# EasyEDA Pro project STM32_SG90稳定平台.eprj

# Schematic STM32_SG90稳定平台V1.1

## Sheets
1 STM32F103C8T6: Create Date: 2023-10-22; Page Name: STM32F103C8T6; Project Name: STM32_SG90稳定平台; Schematic Name: STM32_SG90稳定平台; Update Date: 2023-10-22; Add into BOM: yes; Company: 嘉立创EDA; Convert to PCB: yes; Page Size: A4; Version: V1.0
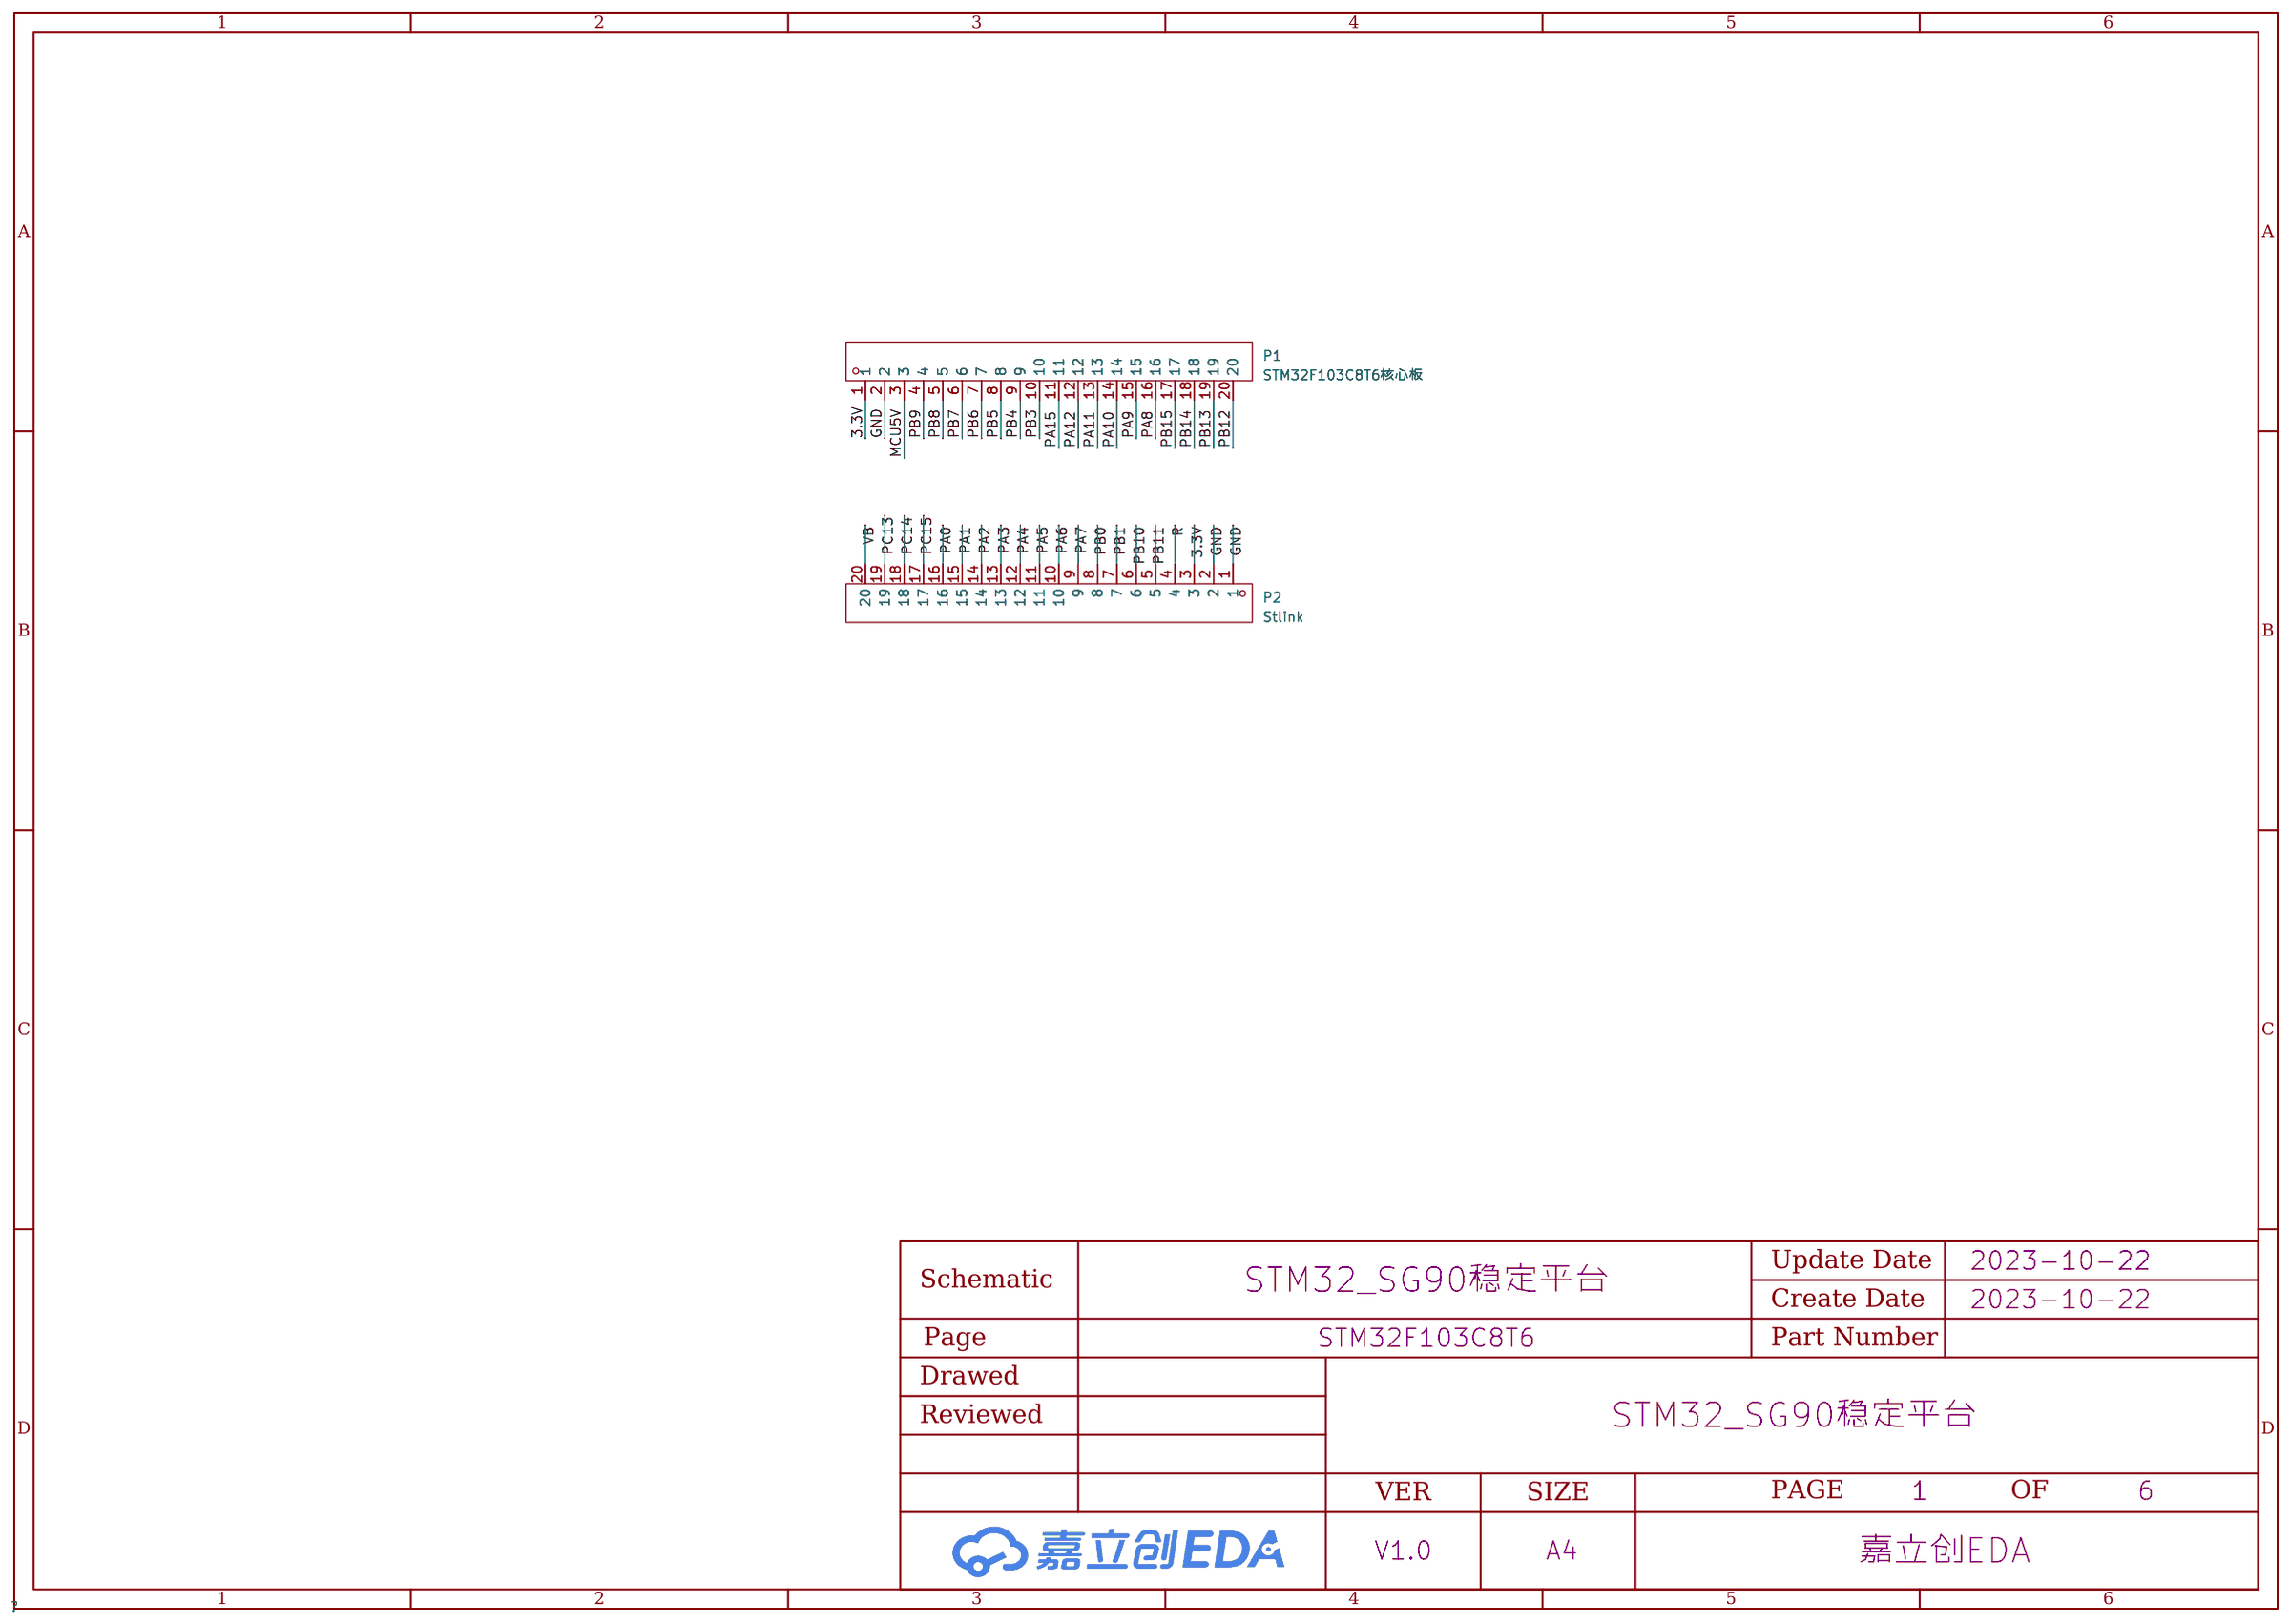
[diagram p0: STM32F103C8T6]
2 MPU6050: Page Name: MPU6050; Schematic Name: STM32_SG90稳定平台V1.1; Update Date: 2023-11-05
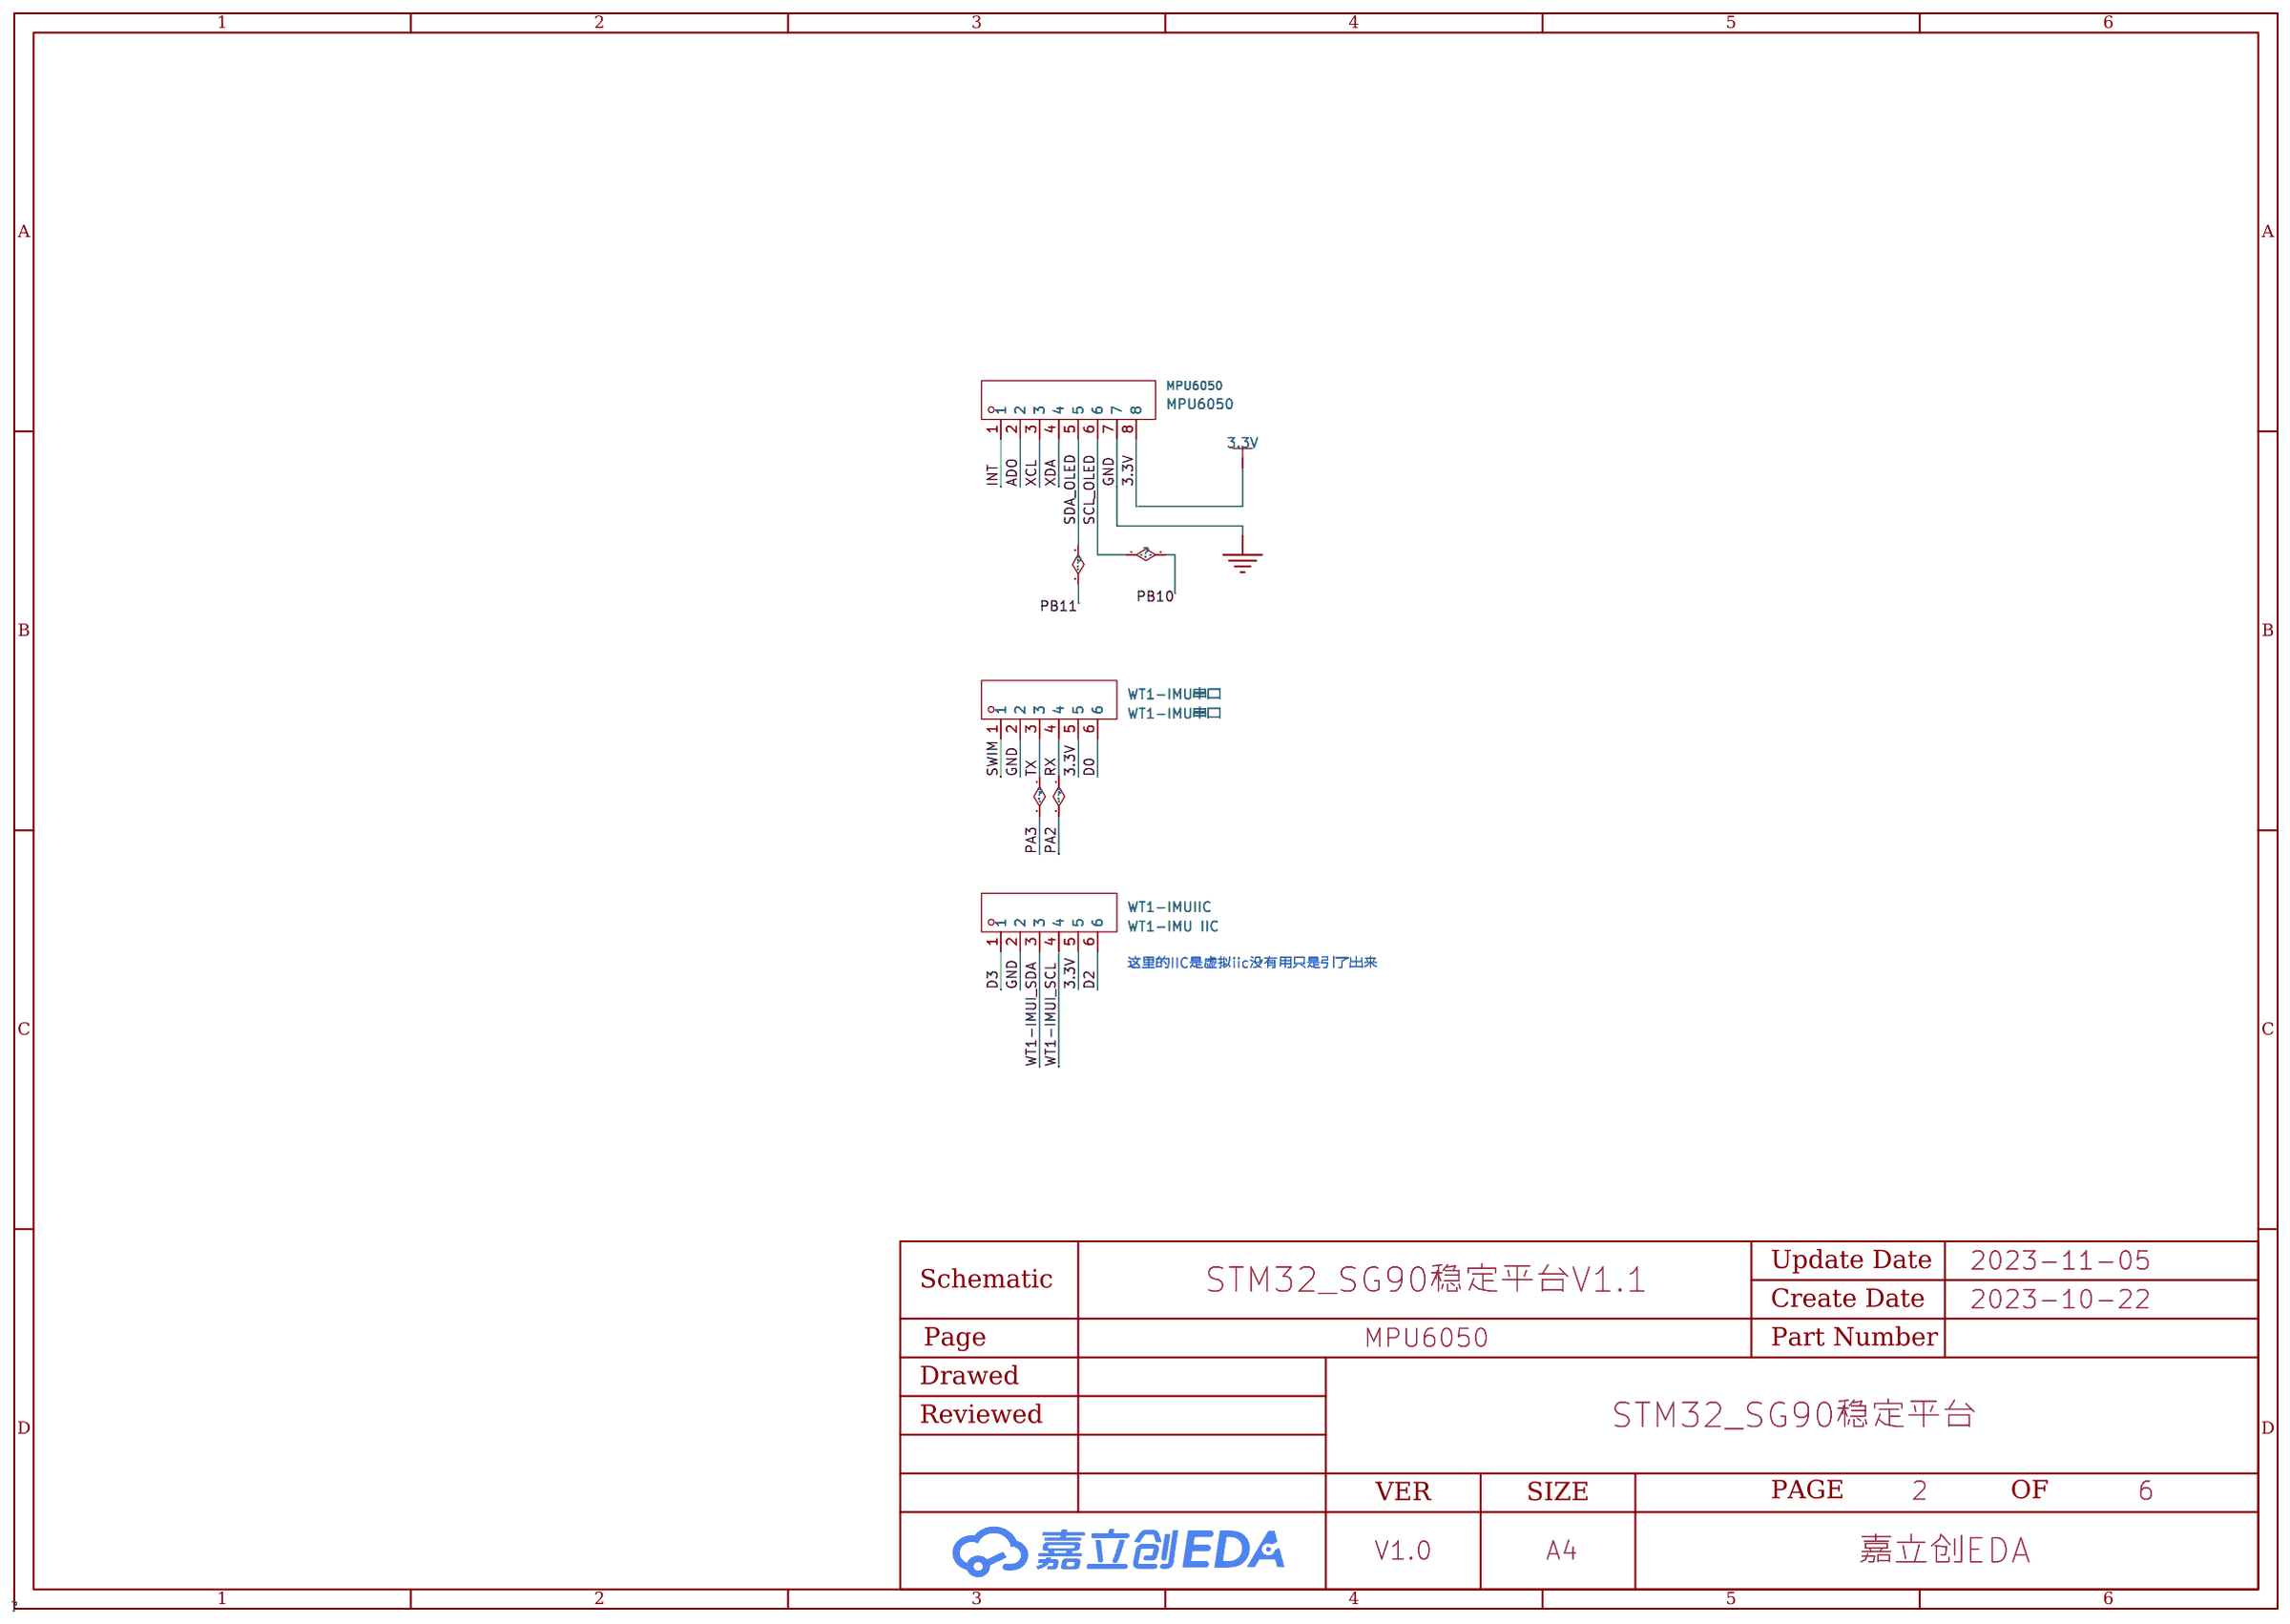
[diagram p1: MPU6050]
3 电源: Page Name: 电源; Schematic Name: STM32_SG90稳定平台V1.1; Update Date: 2023-10-24
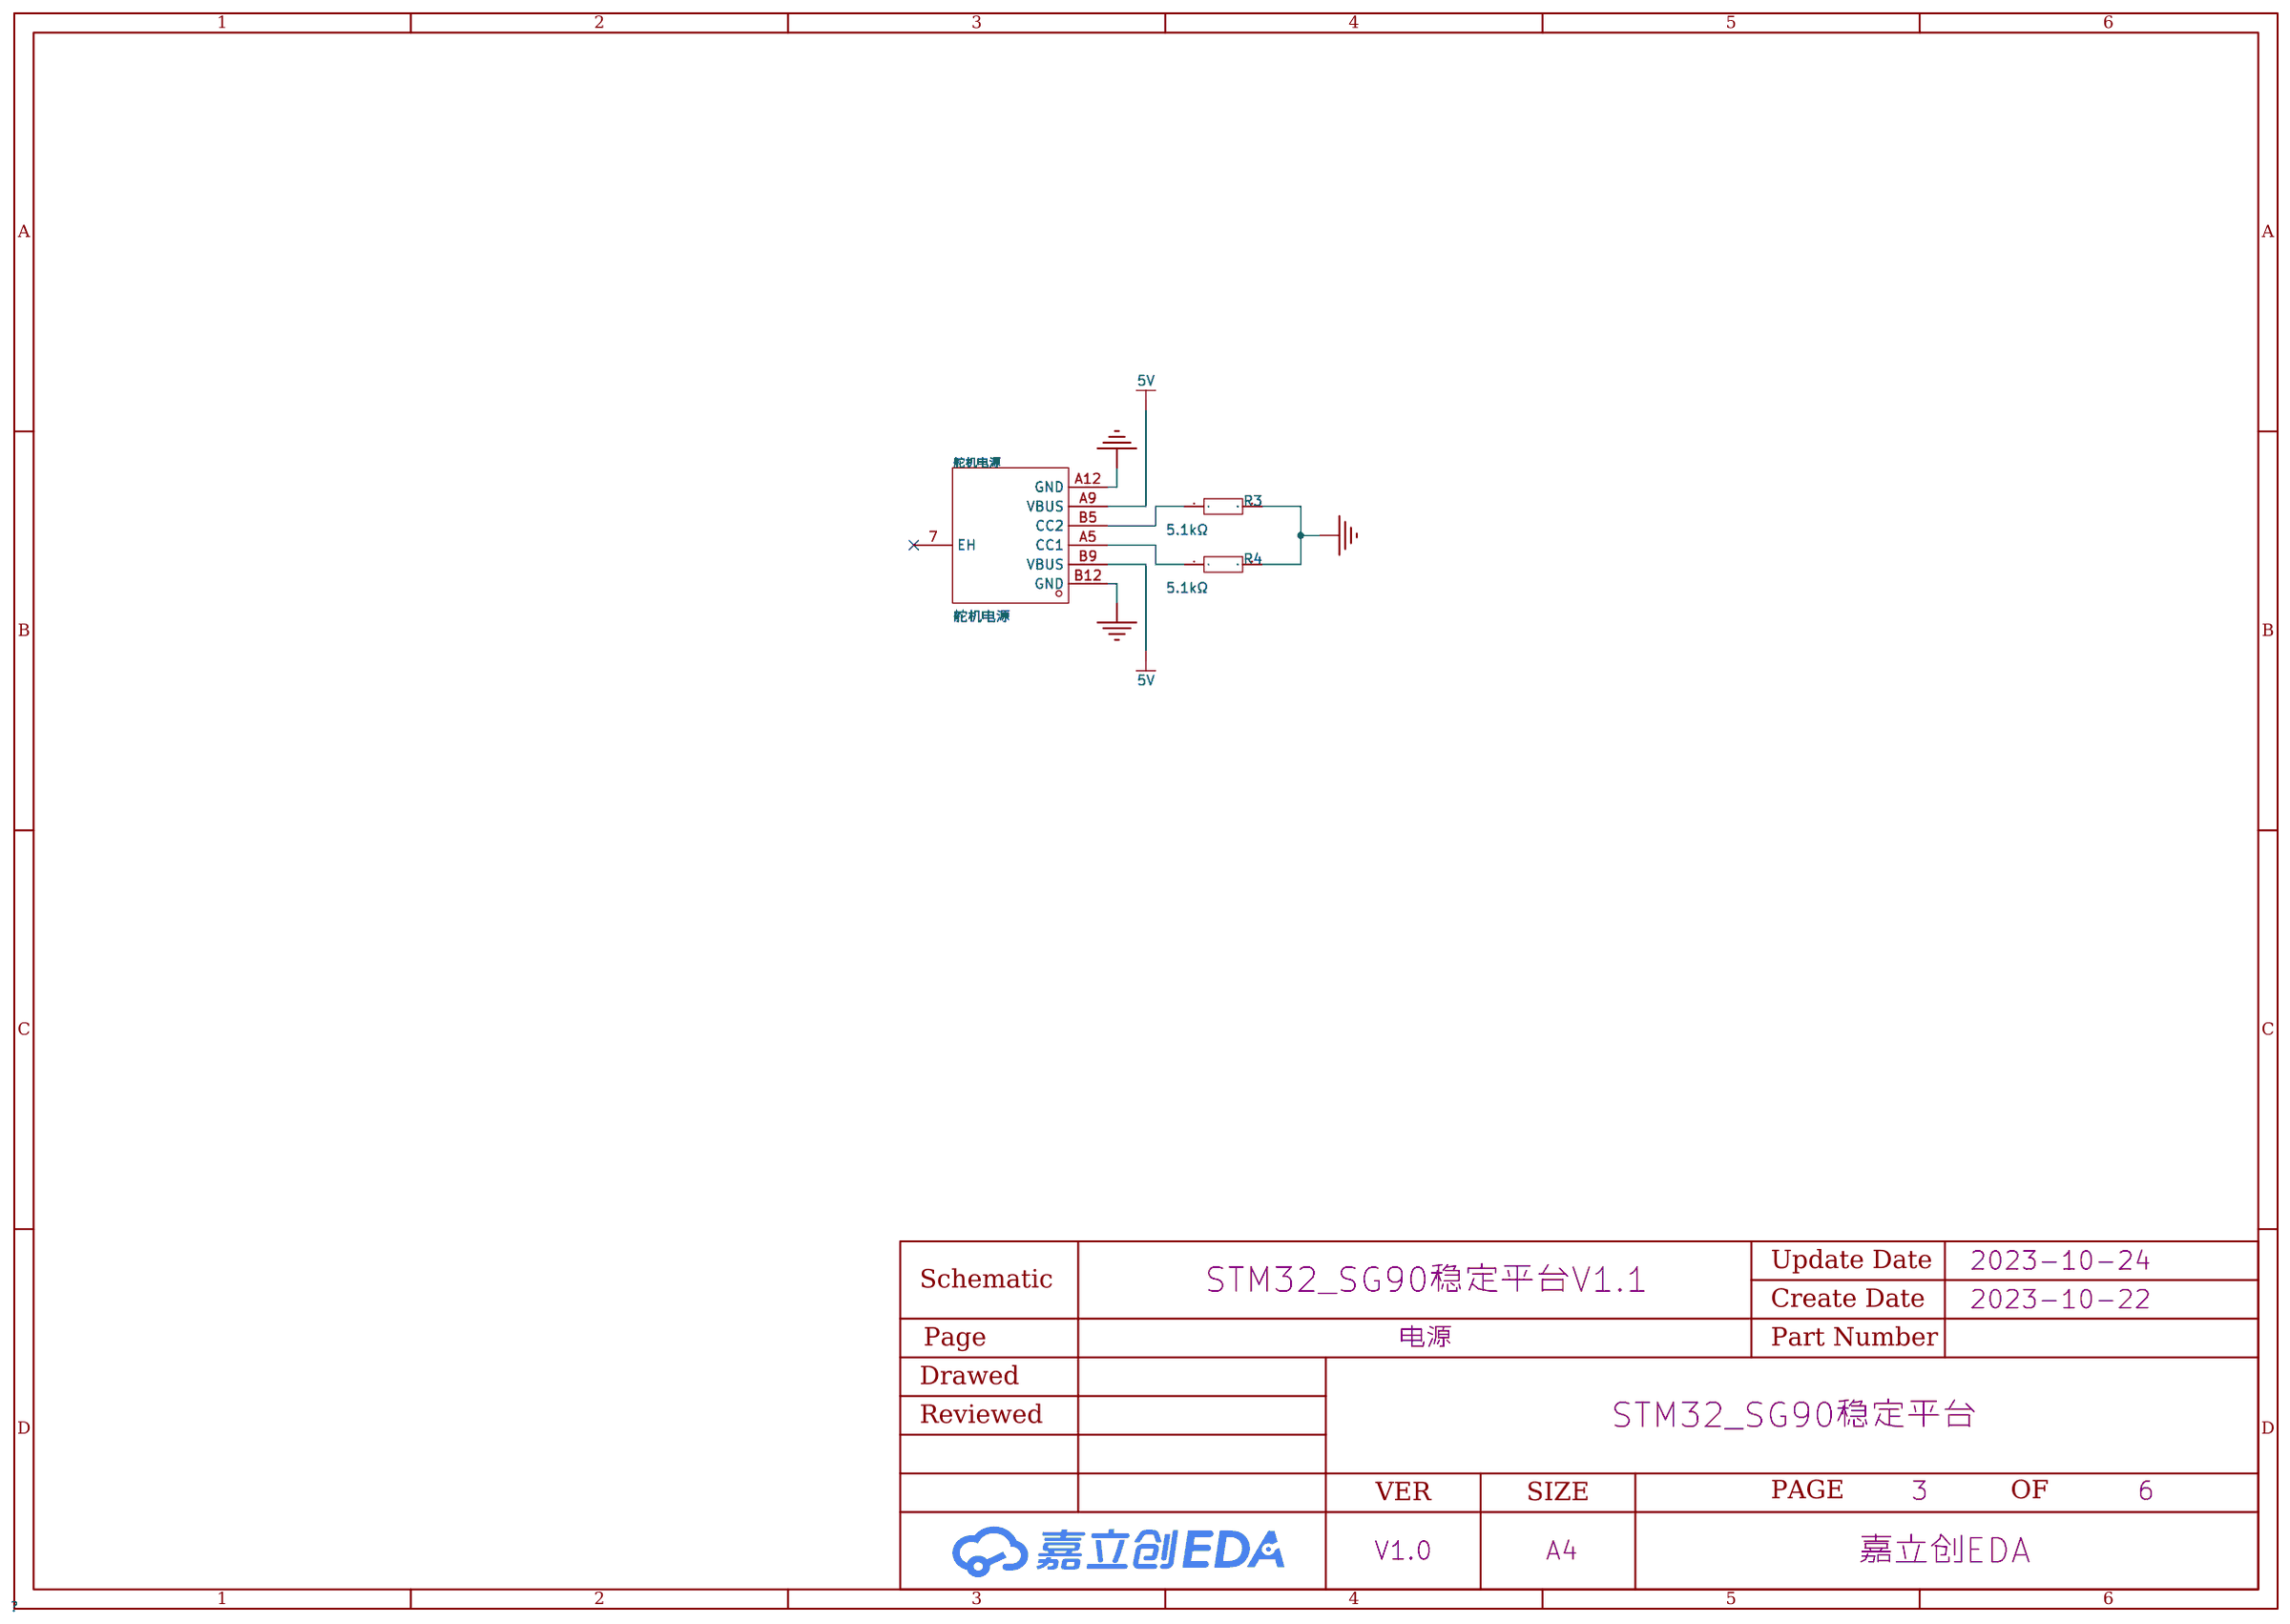
[diagram p2: 电源]
4 OLED: Page Name: OLED; Schematic Name: STM32_SG90稳定平台V1.1; Update Date: 2023-11-05
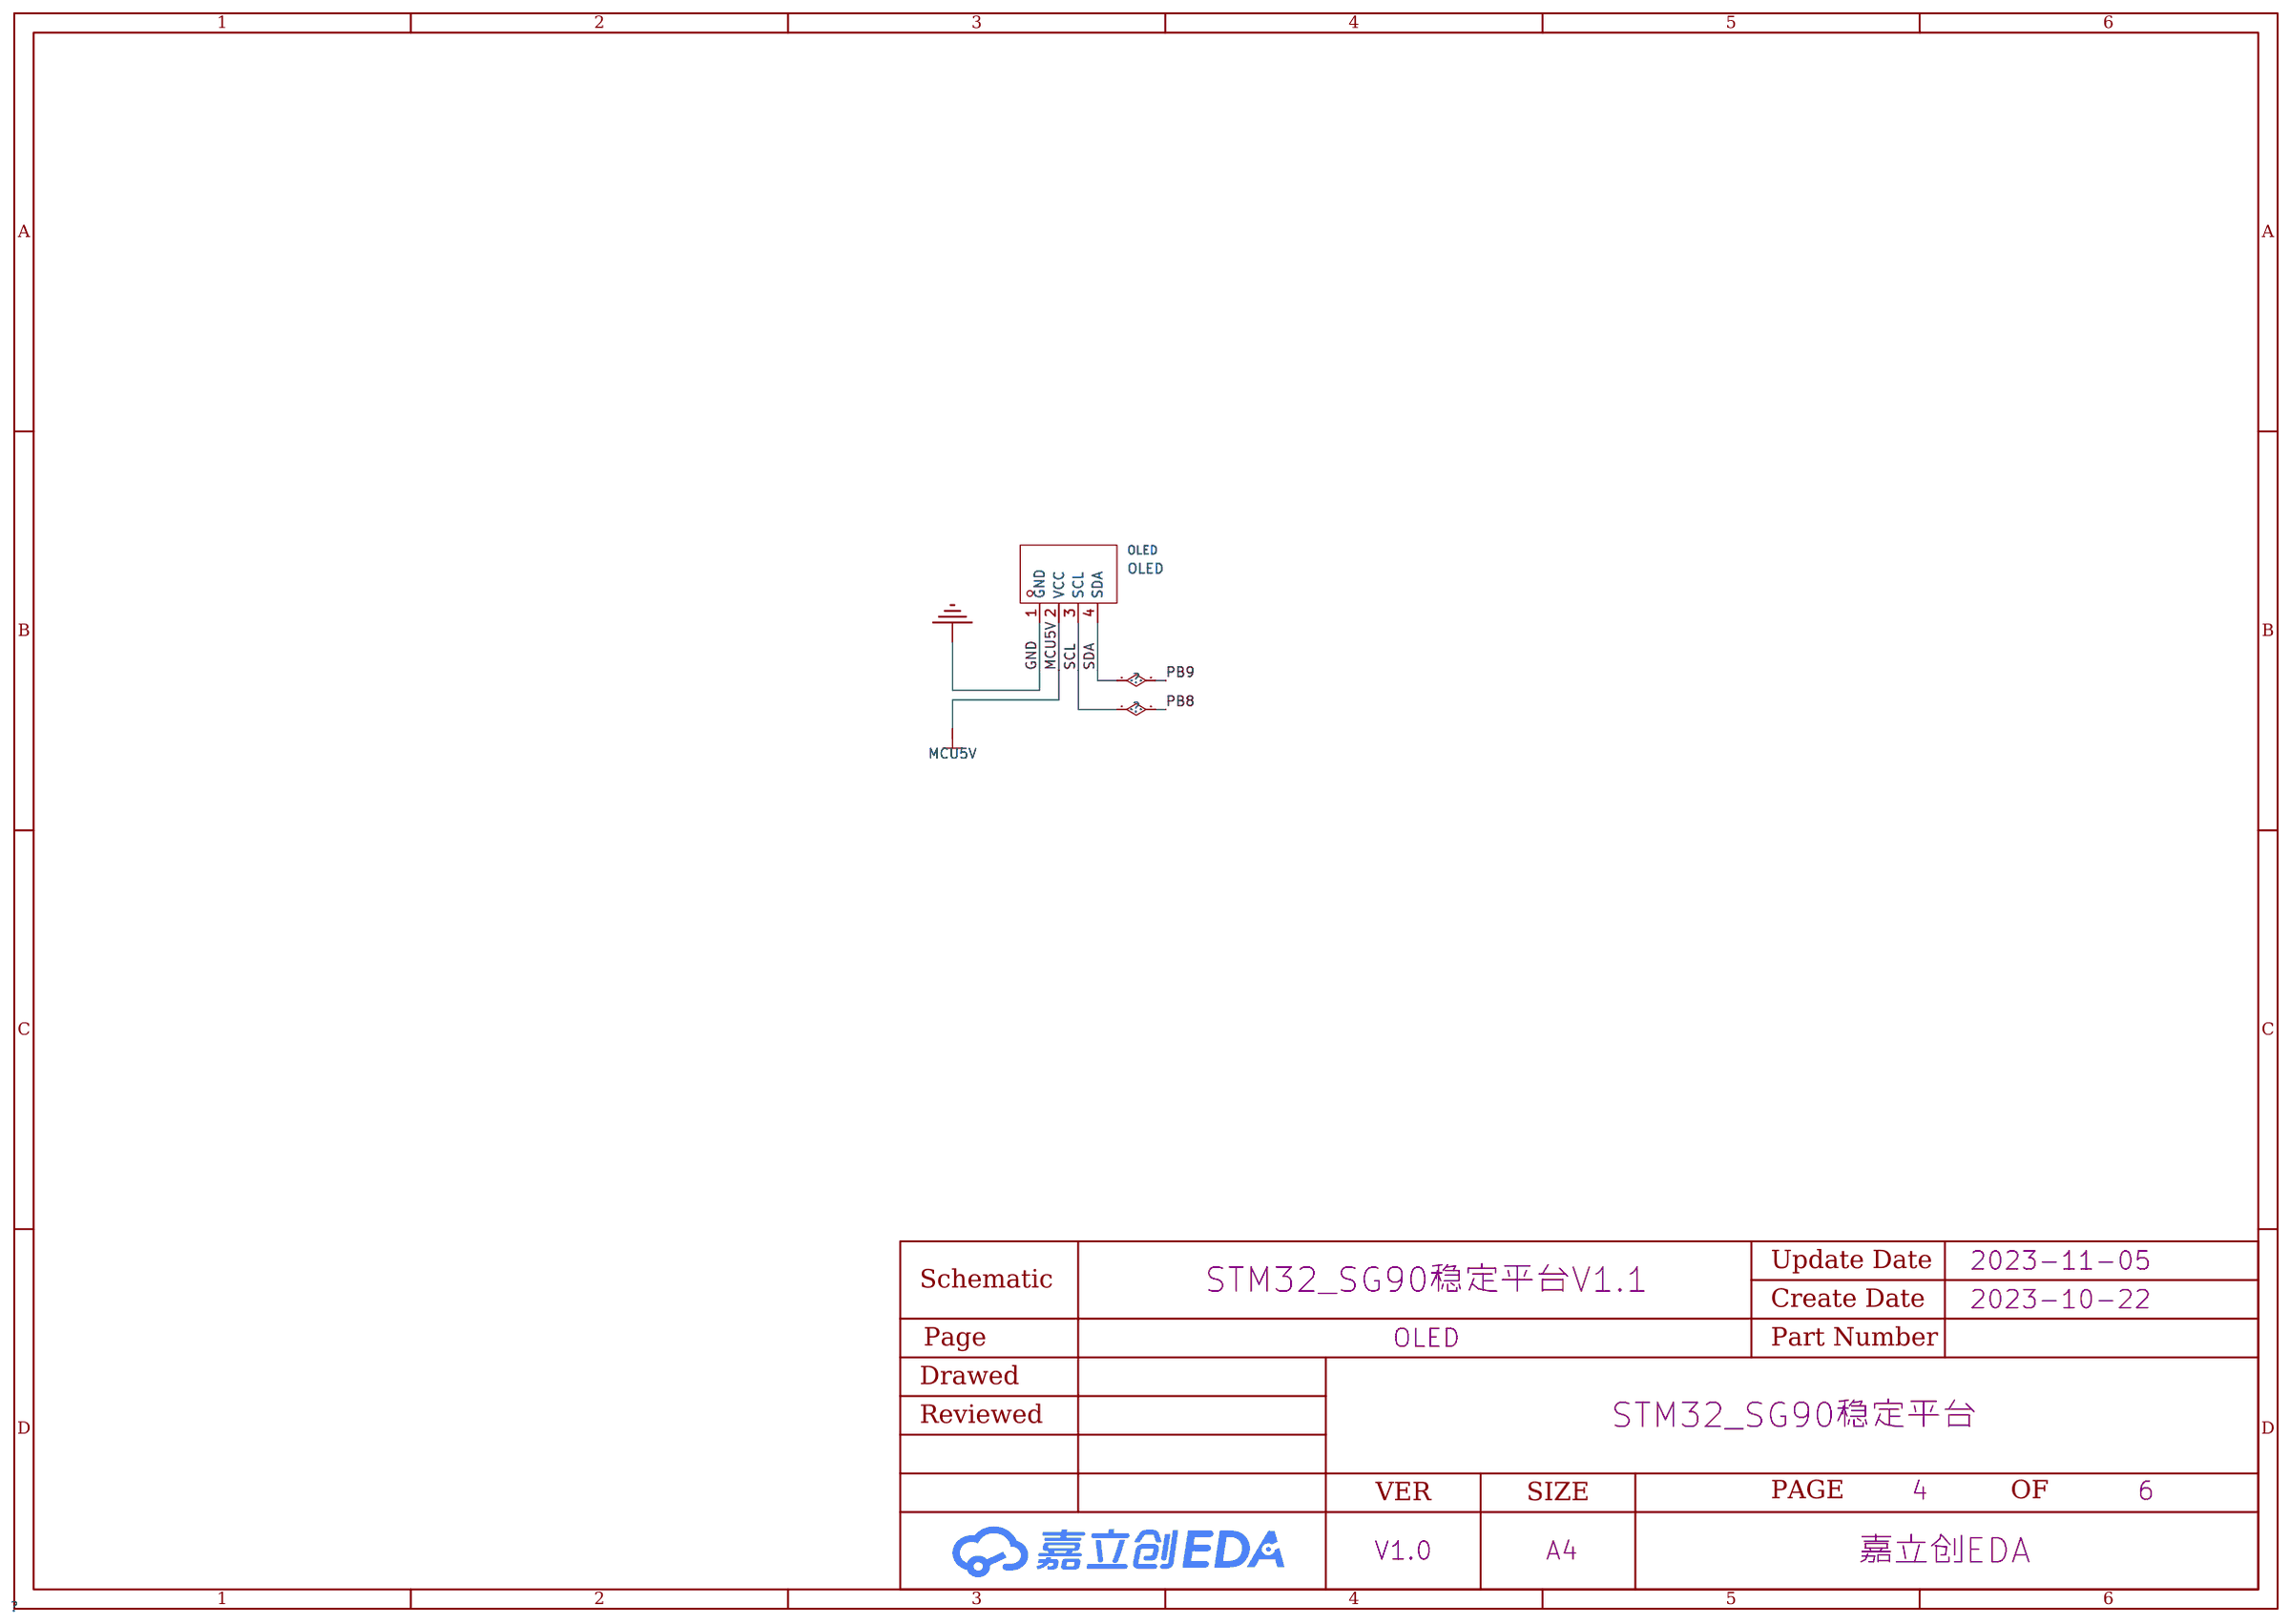
[diagram p3: OLED]
5 SG90舵机: Create Date: 2023-10-23; Page Name: SG90舵机; Schematic Name: STM32_SG90稳定平台V1.1; Update Date: 2023-11-05
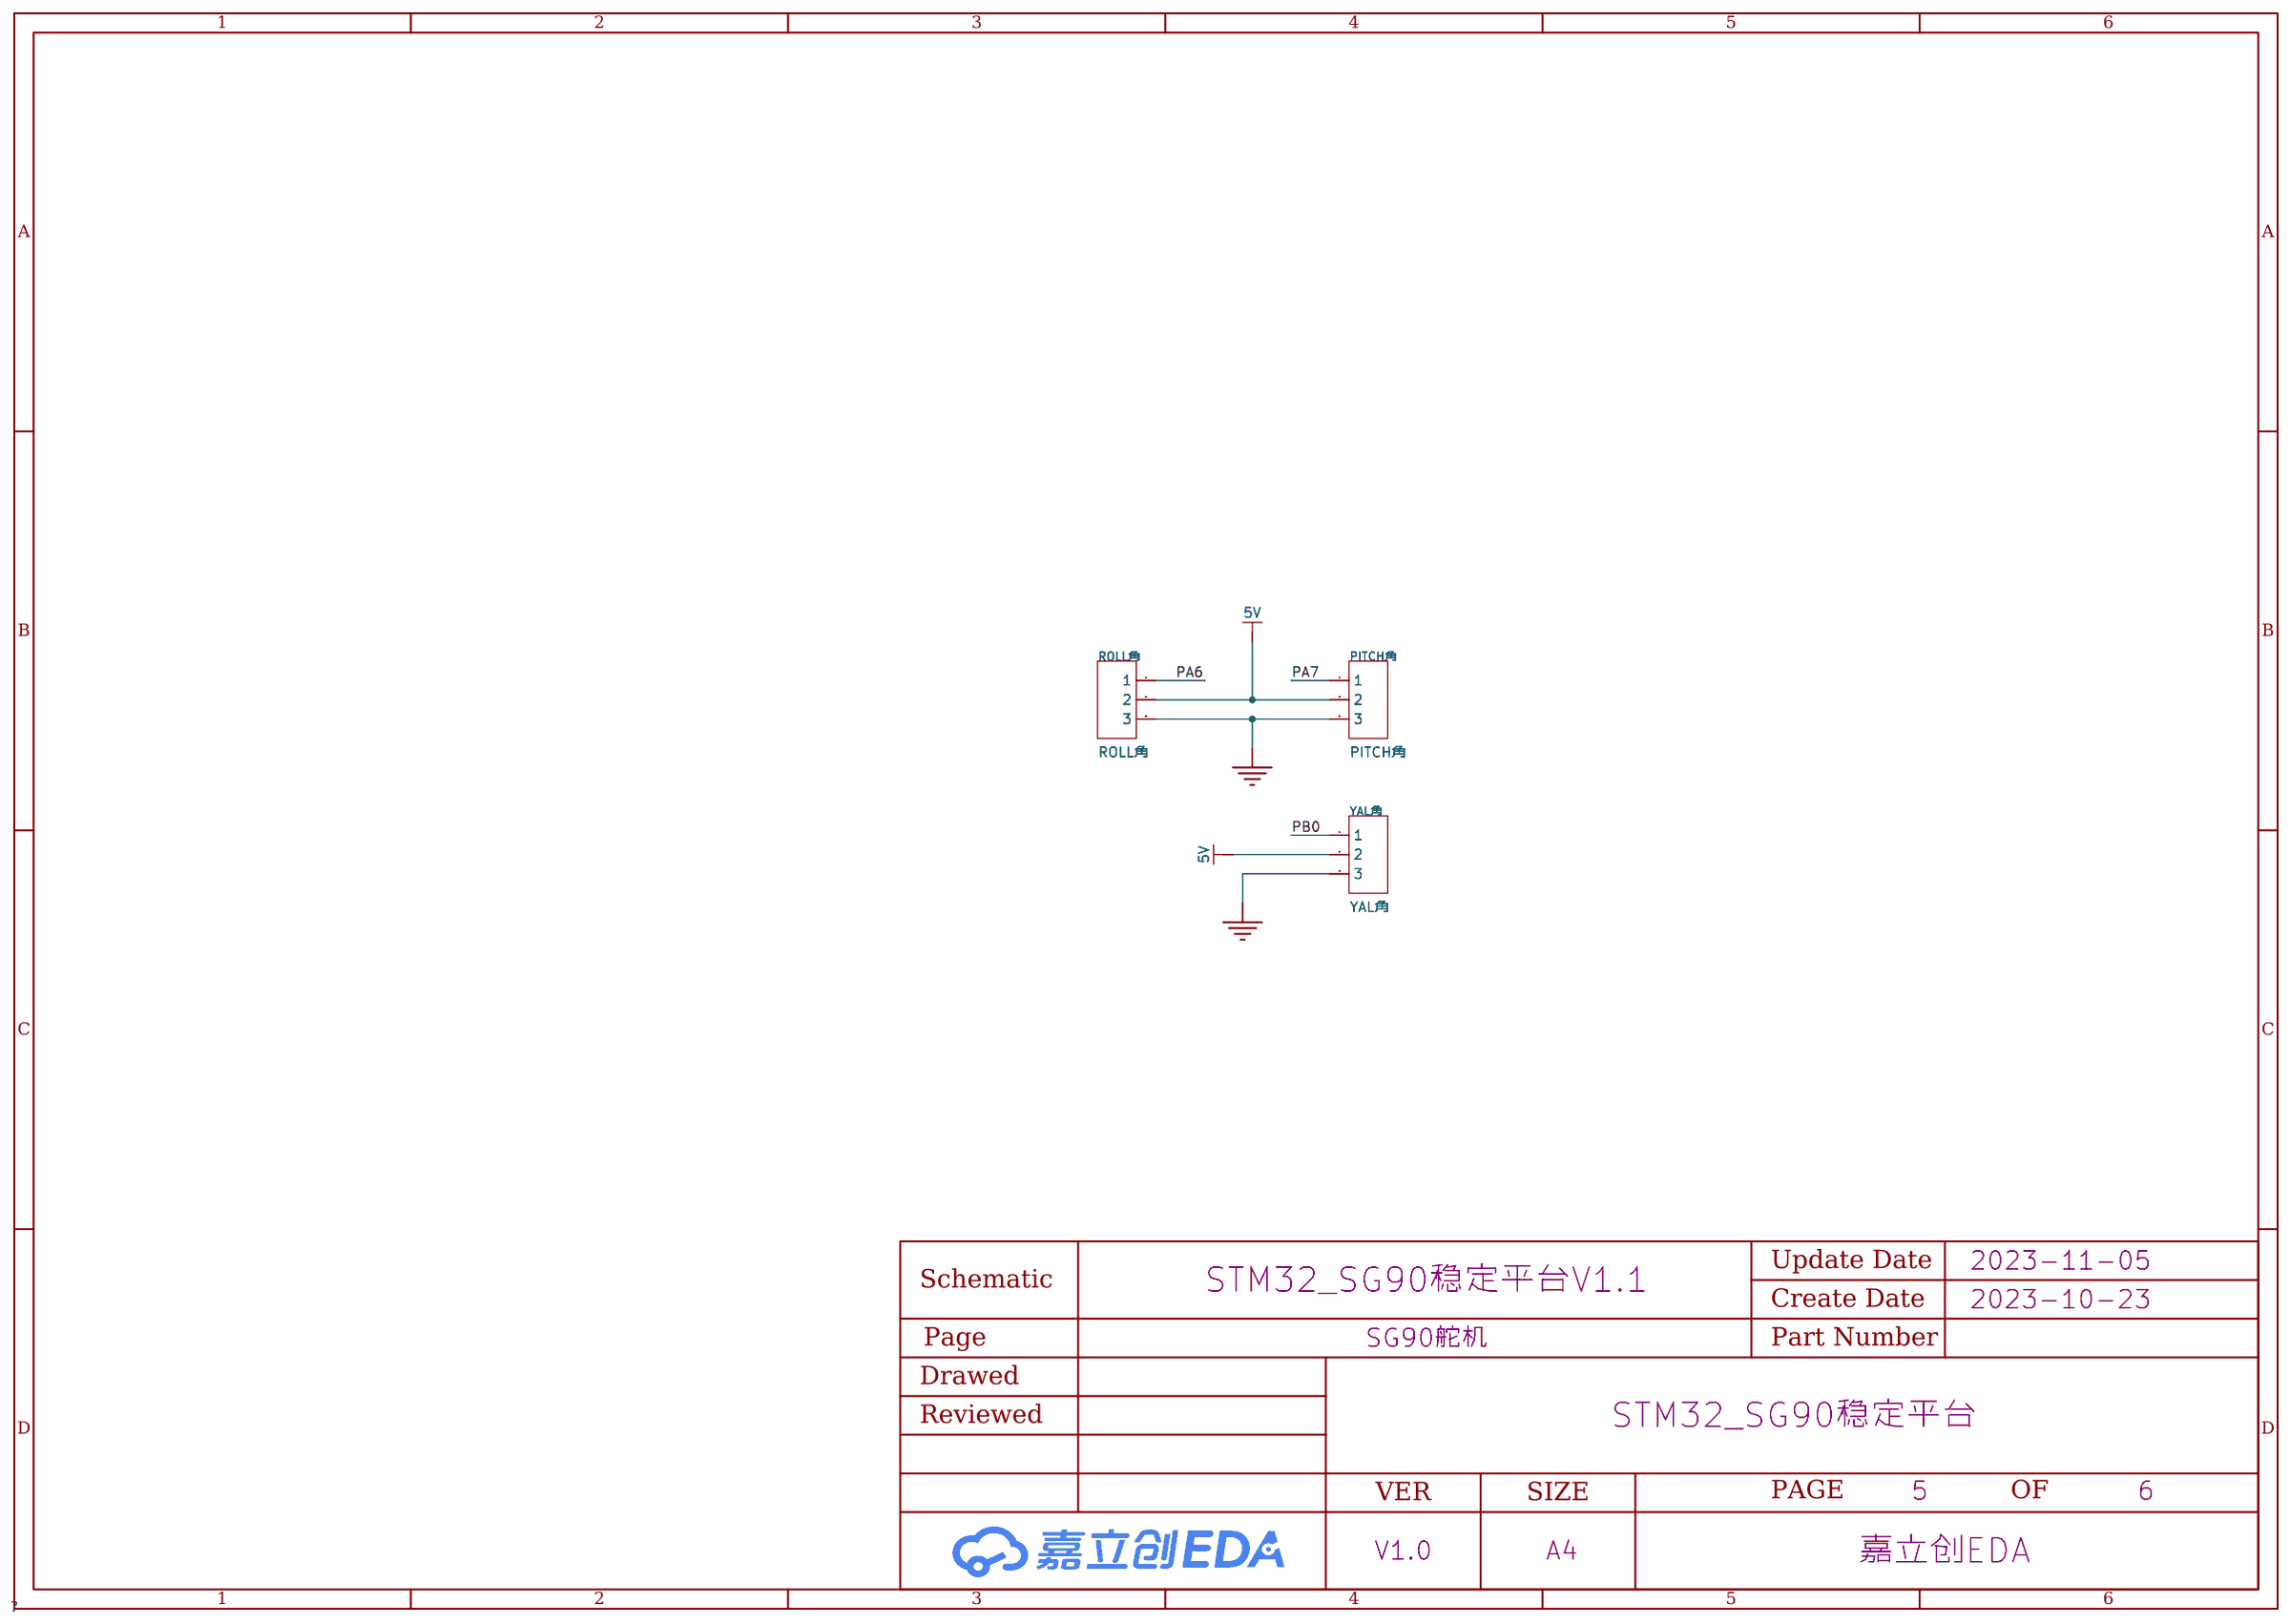
[diagram p4: SG90舵机]
6 串口: Create Date: 2023-10-23; Page Name: 串口; Schematic Name: STM32_SG90稳定平台V1.1; Update Date: 2023-10-24
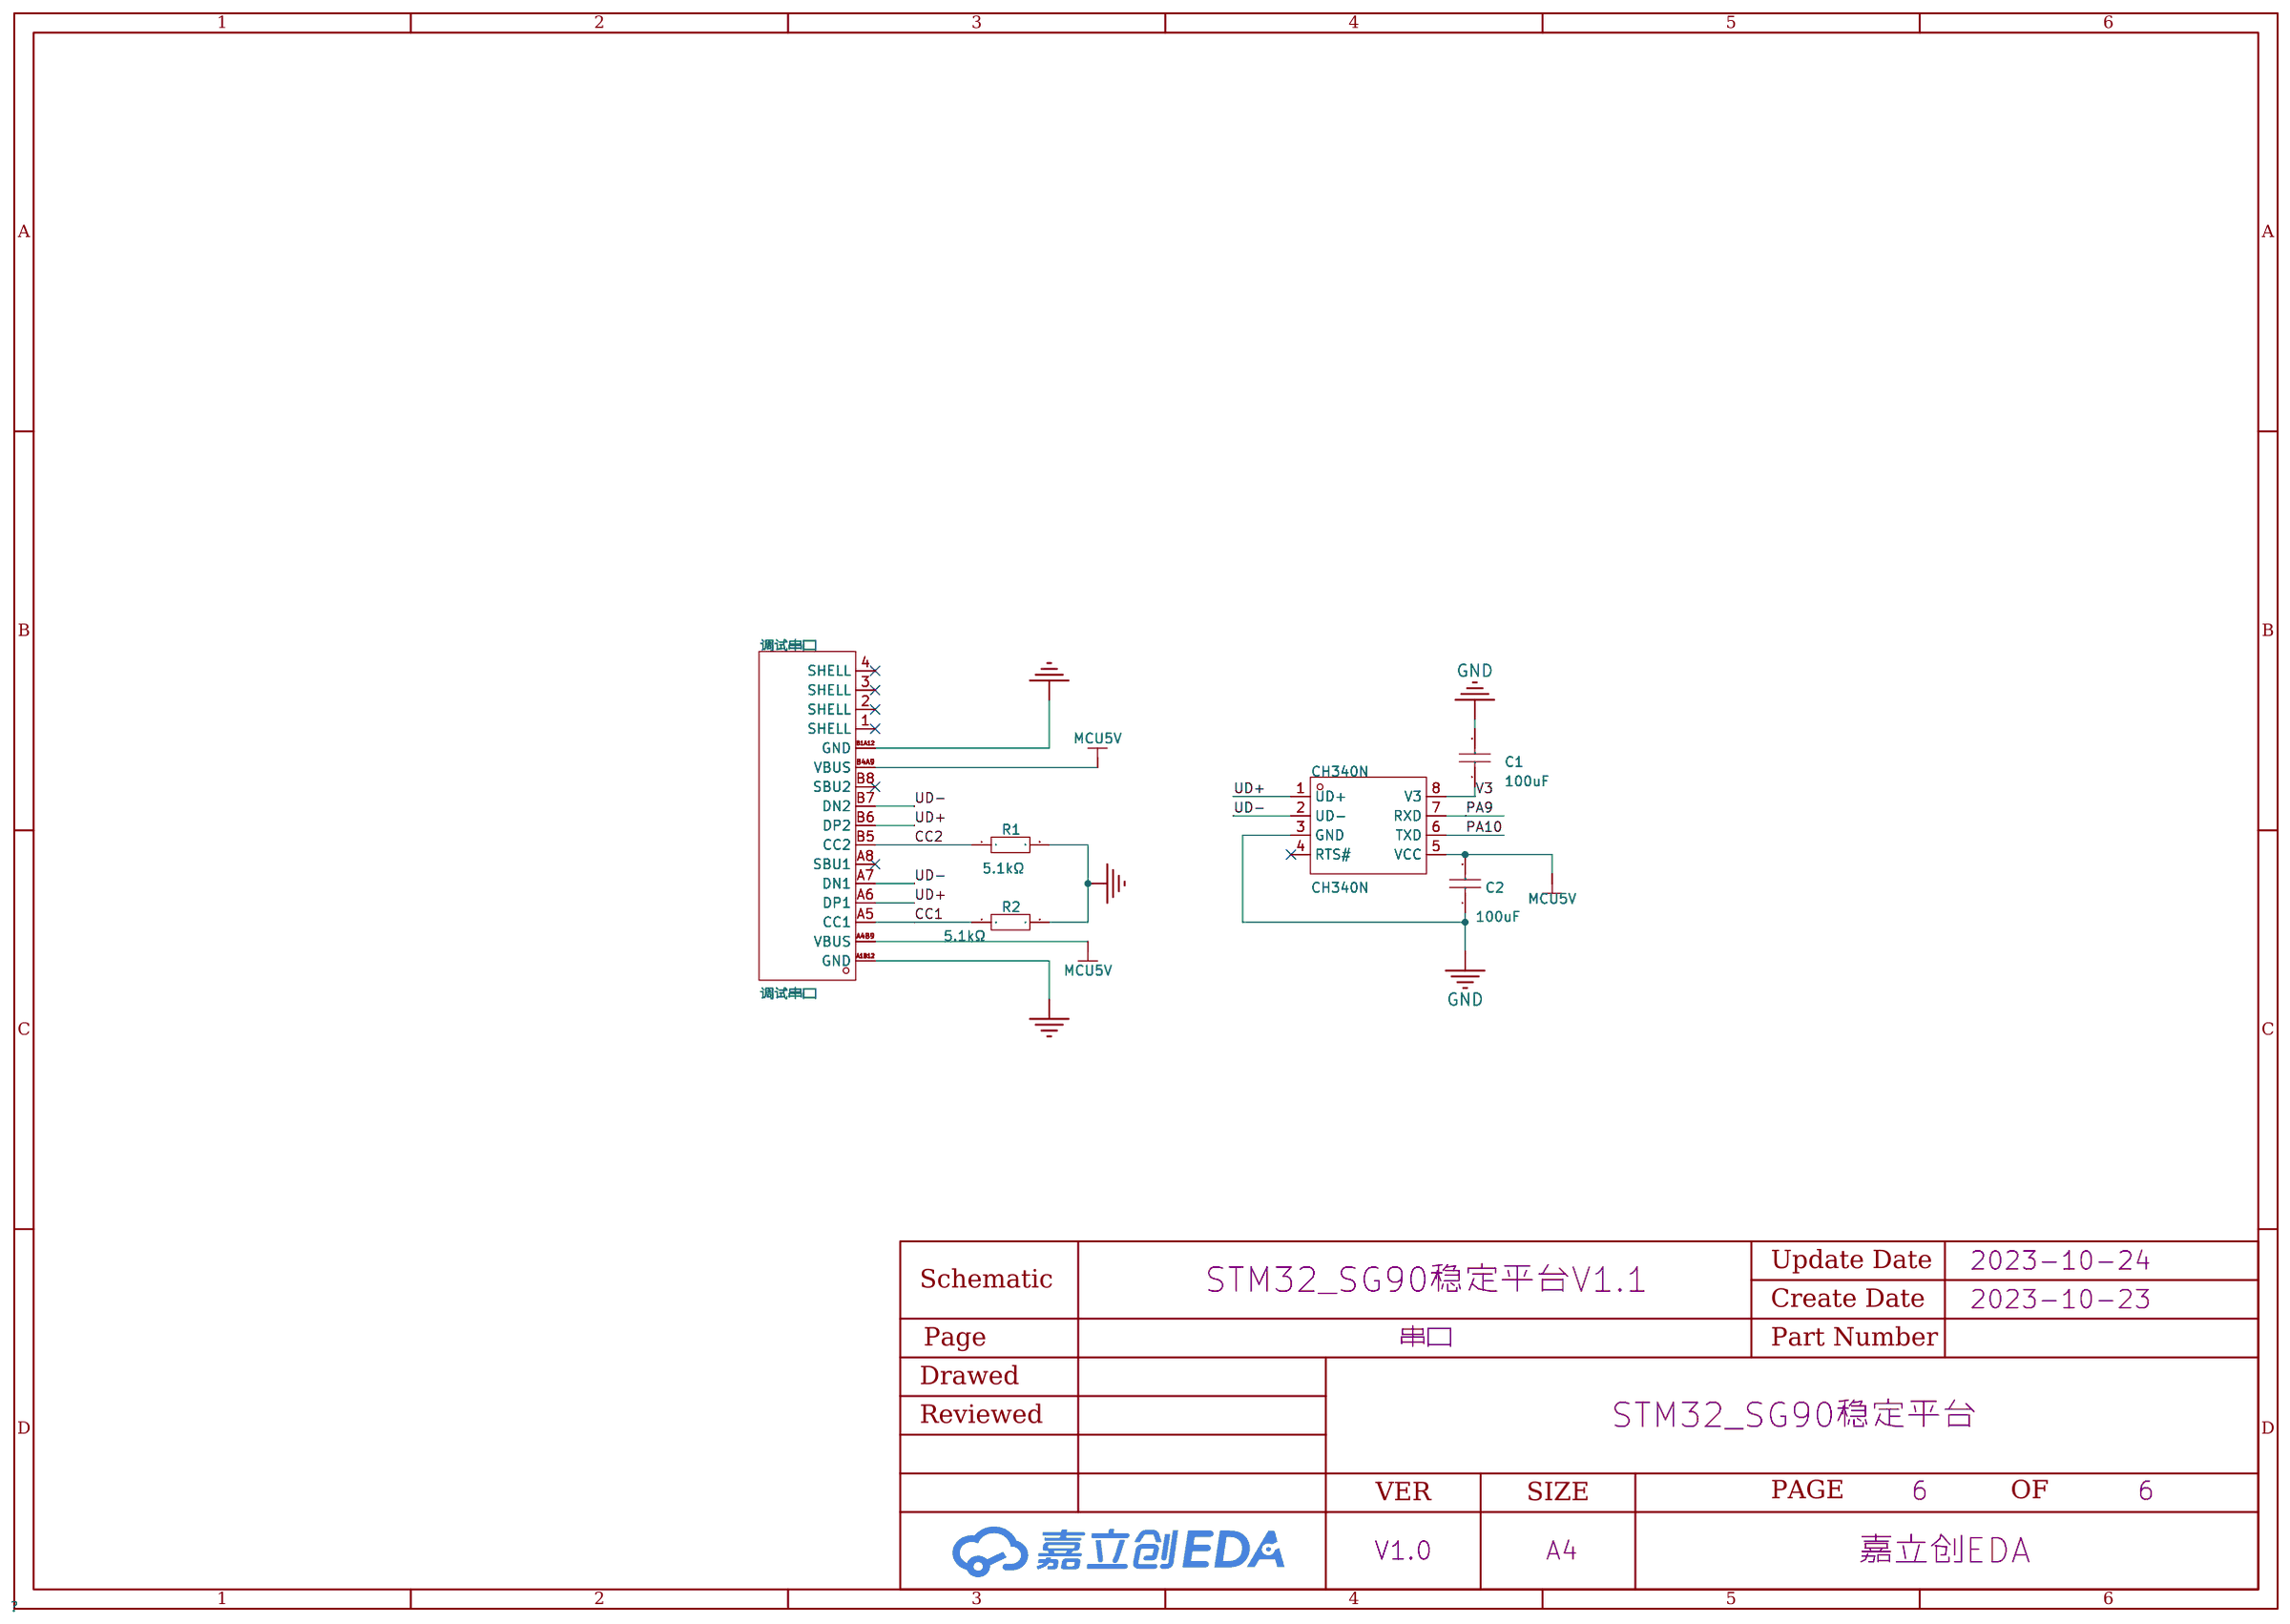
[diagram p5: 串口]

## Parts
sheet MPU6050
MPU6050  MPU6050  [HDR-TH_8P-P2.54-V-F]
WT1-IMUIIC  WT1-IMU IIC  [HDR-TH_6P-P2.54-V-F]
WT1-IMU串口  WT1-IMU串口  [HDR-TH_6P-P2.54-V-F]
sheet OLED
OLED  OLED  [OLED-TH_L27.8-W27.2-P2.54_C9900033791]
sheet SG90舵机
PITCH角  PITCH角  [HDR-TH_3P-P2.54-V-M-1]
ROLL角  ROLL角  [HDR-TH_3P-P2.54-V-M-1]
YAL角  YAL角  [HDR-TH_3P-P2.54-V-M-1]
sheet STM32F103C8T6
P1  STM32F103C8T6核心板  [HDR-TH_20P-P2.54-V-F]
P2  Stlink  [HDR-TH_20P-P2.54-V-F]
sheet 串口
C1  100uF  [C1206]
C2  100uF  [C1206]
CH340N  CH340N  [SOP-8_L4.9-W3.9-P1.27-LS6.0-BL]
R1  5.1kΩ  [R0603]
R2  5.1kΩ  [R0603]
调试串口  调试串口  [USB-C-SMD_TYPE-C16PIN]
sheet 电源
R3  5.1kΩ  [R0603]
R4  5.1kΩ  [R0603]
舵机电源  舵机电源  [TYPE-C-SMD_TYPE-C-6P]

## Library data of the parts
MPU6050 = ZX-PM2.54-1-8PY: 排数:单排;总孔位数:8P;间距:2.54mm;插孔结构:1x8P;行距:-;安装类型:直插;圆孔/方孔:方孔;额定电流:3A;额定电压:1kV;插孔方向:顶部;塑高:8.5mm;触头材质:青铜;触头镀层:金;工作温度范围:-40℃~+105℃;焊接温度(最大值):260℃@5S;; LCSC Part Name: 间距:2.54mm 1x8P 直插; Supplier Part: C7499328; Manufacturer: Megastar(兆星); Supplier Footprint: 插件,P=2.54mm; Datasheet: https://atta.szlcsc.com/upload/public/pdf/source/20230804/D626B3CF681C0E68EA183C516E9CB982.pdf; Supplier: LCSC; Number of Rows: 单排; Number of Holes: 8P; Pitch: 2.54mm; Holes Structure: 1x8P; Mounting Type: 直插; Circular Hole / Square Hole: 方孔; Current Rating (Max): 3A; Voltage Rating (Max): 1kV; Holes Direction: 顶部; Insulation Height: 8.5mm; Contact Material: 青铜; Contact Plating: 金; Operating Temperature Range: -40℃~+105℃; Welding Temperature (Max): 260℃@5S
WT1-IMUIIC WT1-IMU串口 = 2.54-1*6P母: 排数:单排;总孔位数:6P;间距:2.54mm;插孔结构:1x6P;行距:-;安装类型:直插;塑高:-;触头材质:-;触头镀层:-;; LCSC Part Name: 间距:2.54mm 1x6P 直插; Supplier Part: C40877; Manufacturer: BOOMELE(博穆精密); Supplier Footprint: 插件,P=2.54mm; JLCPCB Part Class: 扩展库; Datasheet: https://atta.szlcsc.com/upload/public/pdf/source/20210301/C2718488_F4427B881E42CAA8DDB0B1C12B3A522C.pdf; Supplier: LCSC; Number of Rows: 单排; Number of Holes: 6P; Pitch: 2.54mm; Holes Structure: 1x6P; Mounting Type: 直插
OLED = HS96L03W2C03: 尺寸(inch)：0.96寸 0.96&apos; 像素分辨率：128x64 128*64主控芯片：SSD1315 接口类型：I2C 外形:27.3*27.8；IIC/3SPI/4SPI串口通讯,工作温度范围-40℃—+70℃。4PIN黑底白光。; LCSC Part Name: 0.96寸OLED显示屏窄白光IIC; Supplier Part: C5248080; Manufacturer: HS(汉昇); JLCPCB Part Class: Extended Part; Datasheet: https://atta.szlcsc.com/upload/public/pdf/source/20230627/763D01F79A90007632F098068C7C8AD9.pdf; Supplier: LCSC
PITCH角 ROLL角 YAL角 = 2.54-1*3P针: 排数:单排;总PIN位数:3;间距:2.54mm;插针结构:1x3P;行距:-;安装类型:直插;圆针/方针:方针;额定电流:3A;额定电压:-;配合针长度:-;塑高:-;端接针长度:-;触头材质:-;触头镀层:-;工作温度范围:-40℃~+105℃;颜色:黑色;; LCSC Part Name: 2.54mm 1x3P 直插 方针; Supplier Part: C49257; Manufacturer: BOOMELE(博穆精密); Supplier Footprint: 直插,P=2.54mm; JLCPCB Part Class: 扩展库; Supplier: LCSC; Number of Rows: 单排; Number of Pins: 3; Pitch: 2.54mm; Pin Structure: 1x3P; Mounting Type: 直插; Circluar Pins/Square Pins: 方针; Current Rating (Max): 3A; Operating Temperature Range: -40℃~+105℃; Color: 黑色
P1 P2 = 22850120ANG1SYA01: 排数:单排;总孔位数:20P;间距:2.54mm;插孔结构:1x20P;行距:-;安装类型:直插;塑高:-;触头材质:黄铜;触头镀层:-;; LCSC Part Name: 间距:2.54mm 1x20P 直插; Supplier Part: C429947; Manufacturer: JILN(锦凌); Supplier Footprint: 插件,P=2.54mm; JLCPCB Part Class: 扩展库; Datasheet: https://atta.szlcsc.com/upload/public/pdf/source/20190920/C429966_F6288D72CB1EF194DAF75E8AC5D57877.pdf; Supplier: LCSC; Number of Rows: 单排; Number of Holes: 20P; Pitch: 2.54mm; Holes Structure: 1x20P; Mounting Type: 直插; Contact Material: 黄铜
C1 C2 = CL31A107MQHNNNE: 容值:100uF;精度:±20%;额定电压:6.3V;材质(温度系数):X5R;; LCSC Part Name: 100uF ±20% 6.3V; Supplier Part: C15008; Manufacturer: SAMSUNG(三星); Supplier Footprint: 1206; JLCPCB Part Class: Basic Part; Datasheet: https://atta.szlcsc.com/upload/public/pdf/source/20160103/1457707673200.pdf; Supplier: LCSC; Tolerance: ±20%; Voltage Rated: 6.3V; Temperature Coefficient: X5R
CH340N = CH340N: Supplier Part: C2977777; Manufacturer: WCH(南京沁恒); Supplier Footprint: SOP-8; JLCPCB Part Class: Extended Part; Datasheet: https://atta.szlcsc.com/upload/public/pdf/source/20220223/82A45E4FF89B3EDCAD50B354450A7EF4.pdf; Supplier: LCSC
R1-R4 = 0603WAF1002T5E: 电阻类型:厚膜电阻;阻值:10kΩ;精度:±1%;功率:100mW;; LCSC Part Name: 厚膜电阻 10kΩ ±1% 100mW; Supplier Part: C25804; Manufacturer: UNI-ROYAL(厚声); Supplier Footprint: 0603; JLCPCB Part Class: 基础库; Datasheet: https://atta.szlcsc.com/upload/public/pdf/source/20200306/C422600_1E6D84923E4A46A82E41ADD87F860B5C.pdf; Supplier: LCSC; Type: 厚膜电阻; Tolerance: ±1%; Power(Watts): 100mW; Temperature Coefficient: ±100ppm/℃; Overload Voltage (Max): 75V; Operating Temperature Range: -55℃~+155℃
调试串口 = TYPE-C16PIN: 连接器类型:Type-C;标准:-;公母:母座;触点数量:16;端口数量:1;安装方式:卧贴;额定电流 - 电源:3A;工作温度范围:-40℃~+85℃;; LCSC Part Name: Type-C 母座 卧贴 快充闪充 停产; Supplier Part: C393939; Manufacturer: SHOU HAN(首韩); Supplier Footprint: SMD; JLCPCB Part Class: Extended Part; Datasheet: https://atta.szlcsc.com/upload/public/pdf/source/20190521/C393939_7B9043D4CF1026AF443AB60D91FBCD5C.pdf; Supplier: LCSC; Connector Type: Type-C; Gender: 母座; Number of Contacts: 16; Number of Ports: 1; Mounting Style: 卧贴; Current Rating - Power (Max): 3A; Operating Temperature Range: -40℃~+85℃
舵机电源 = TYPE-C 6P(073): 连接器类型:Type-C;标准:-;公母:母座;触点数量:6P;端口数量:1;安装方式:卧贴;额定电流 - 电源:5A;工作温度范围:-25℃~+85℃;; LCSC Part Name: Type-C 母座 卧贴; Supplier Part: C668623; Manufacturer: SHOU HAN(首韩); Supplier Footprint: SMD; JLCPCB Part Class: Extended Part; Datasheet: https://atta.szlcsc.com/upload/public/pdf/source/20200618/C668623_A4B260DED7AC1949BAC6AE39E9F4CD80.pdf; Supplier: LCSC; Connector Type: Type-C; Gender: 母座; Number of Contacts: 6P; Number of Ports: 1; Mounting Style: 卧贴; Current Rating - Power (Max): 5A; Operating Temperature Range: -25℃~+85℃

## Nets
3.3V: MPU6050.8 P1.1 P2.3 WT1-IMUIIC.5 WT1-IMU串口.5
5V: PITCH角.2 ROLL角.2 YAL角.2 舵机电源.A9(VBUS) 舵机电源.B9(VBUS)
GND: C1.1 C2.1 CH340N.3(GND) MPU6050.7 OLED.1(GND) P1.2 P2.1 P2.2 PITCH角.3 R1.2 R2.2 R3.2 R4.2 ROLL角.3 WT1-IMUIIC.2 WT1-IMU串口.2 YAL角.3 舵机电源.A12(GND) 舵机电源.B12(GND) 调试串口.A1B12(GND) 调试串口.B1A12(GND)
V3: C1.2 CH340N.8(V3)
ADO: MPU6050.2
CC1: R2.1 调试串口.A5(CC1)
CC2: R1.1 调试串口.B5(CC2)
D0: WT1-IMU串口.6
D2: WT1-IMUIIC.6
D3: WT1-IMUIIC.1
INT: MPU6050.1
MCU5V: C2.2 CH340N.5(VCC) OLED.2(VCC) P1.3 调试串口.A4B9(VBUS) 调试串口.B4A9(VBUS)
PA0: P2.16
PA1: P2.15
PA2: P2.14 WT1-IMU串口.4
PA3: P2.13 WT1-IMU串口.3
PA4: P2.12
PA5: P2.11
PA6: P2.10 ROLL角.1
PA7: P2.9 PITCH角.1
PA8: P1.16
PA9: CH340N.7(RXD) P1.15
PA10: CH340N.6(TXD) P1.14
PA11: P1.13
PA12: P1.12
PA15: P1.11
PB0: P2.8 YAL角.1
PB1: P2.7
PB3: P1.10
PB4: P1.9
PB5: P1.8
PB6: P1.7
PB7: P1.6
PB8: OLED.3(SCL) P1.5
PB9: OLED.4(SDA) P1.4
PB10: MPU6050.6 P2.6
PB11: MPU6050.5 P2.5
PB12: P1.20
PB13: P1.19
PB14: P1.18
PB15: P1.17
PC13: P2.19
PC14: P2.18
PC15: P2.17
R: P2.4
SWIM: WT1-IMU串口.1
UD+: CH340N.1(UD+) 调试串口.A6(DP1) 调试串口.B6(DP2)
UD-: CH340N.2(UD-) 调试串口.A7(DN1) 调试串口.B7(DN2)
VB: P2.20
WT1-IMUI_SCL: WT1-IMUIIC.4
WT1-IMUI_SDA: WT1-IMUIIC.3
XCL: MPU6050.3
XDA: MPU6050.4
$3N1347: R3.1 舵机电源.B5(CC2)
$3N1356: R4.1 舵机电源.A5(CC1)

Not connected (* = marked no-connect by the designer): CH340N 4(RTS#)*; 舵机电源 7(EH)*; 调试串口 1(SHELL)* 2(SHELL)* 3(SHELL)* 4(SHELL)* A8(SBU1)* B8(SBU2)*

## Notes on the sheets
sheet 2
- 这里的IIC是虚拟iic没有用只是引了出来

# Board PCB1
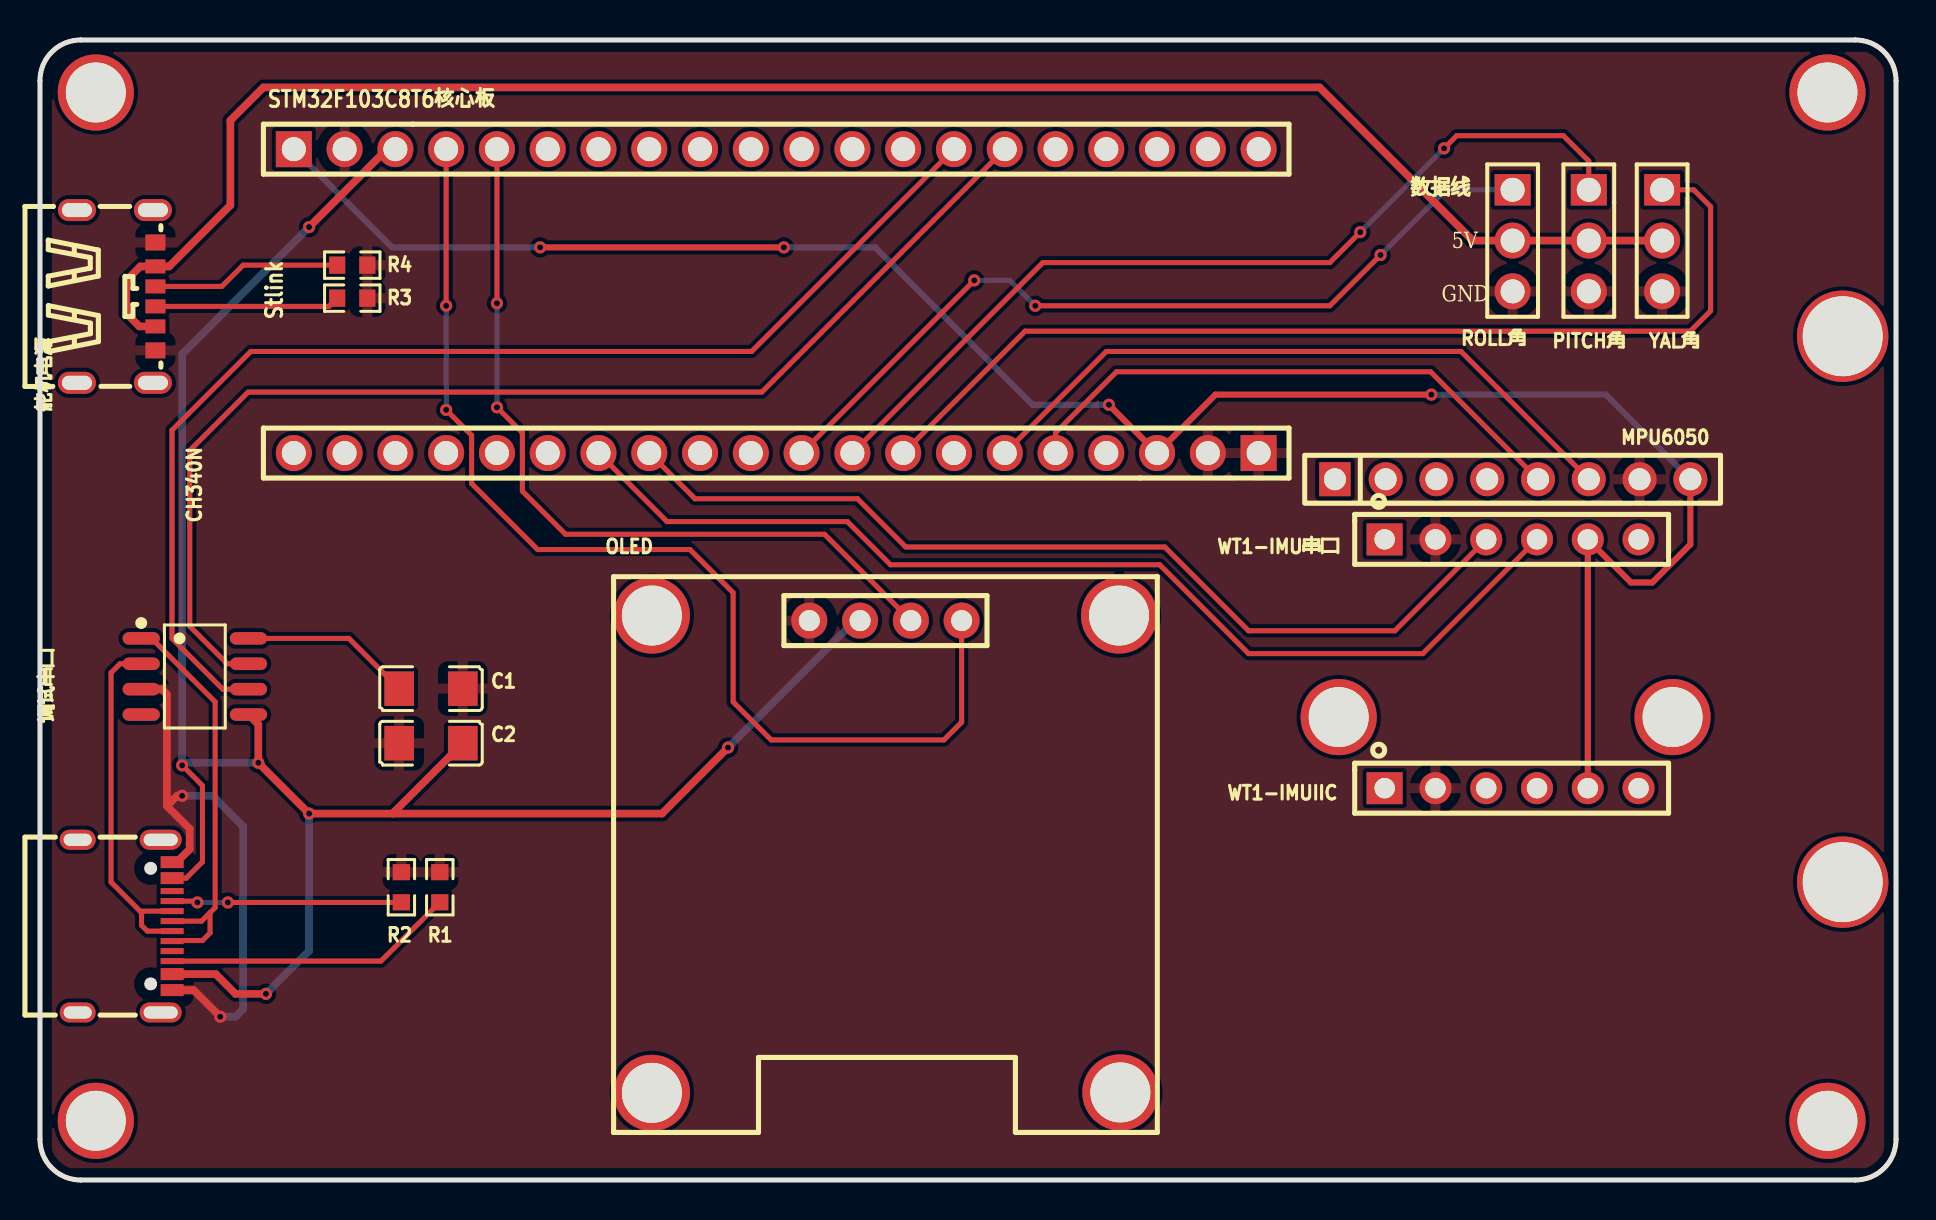
[diagram p6: board, top side]
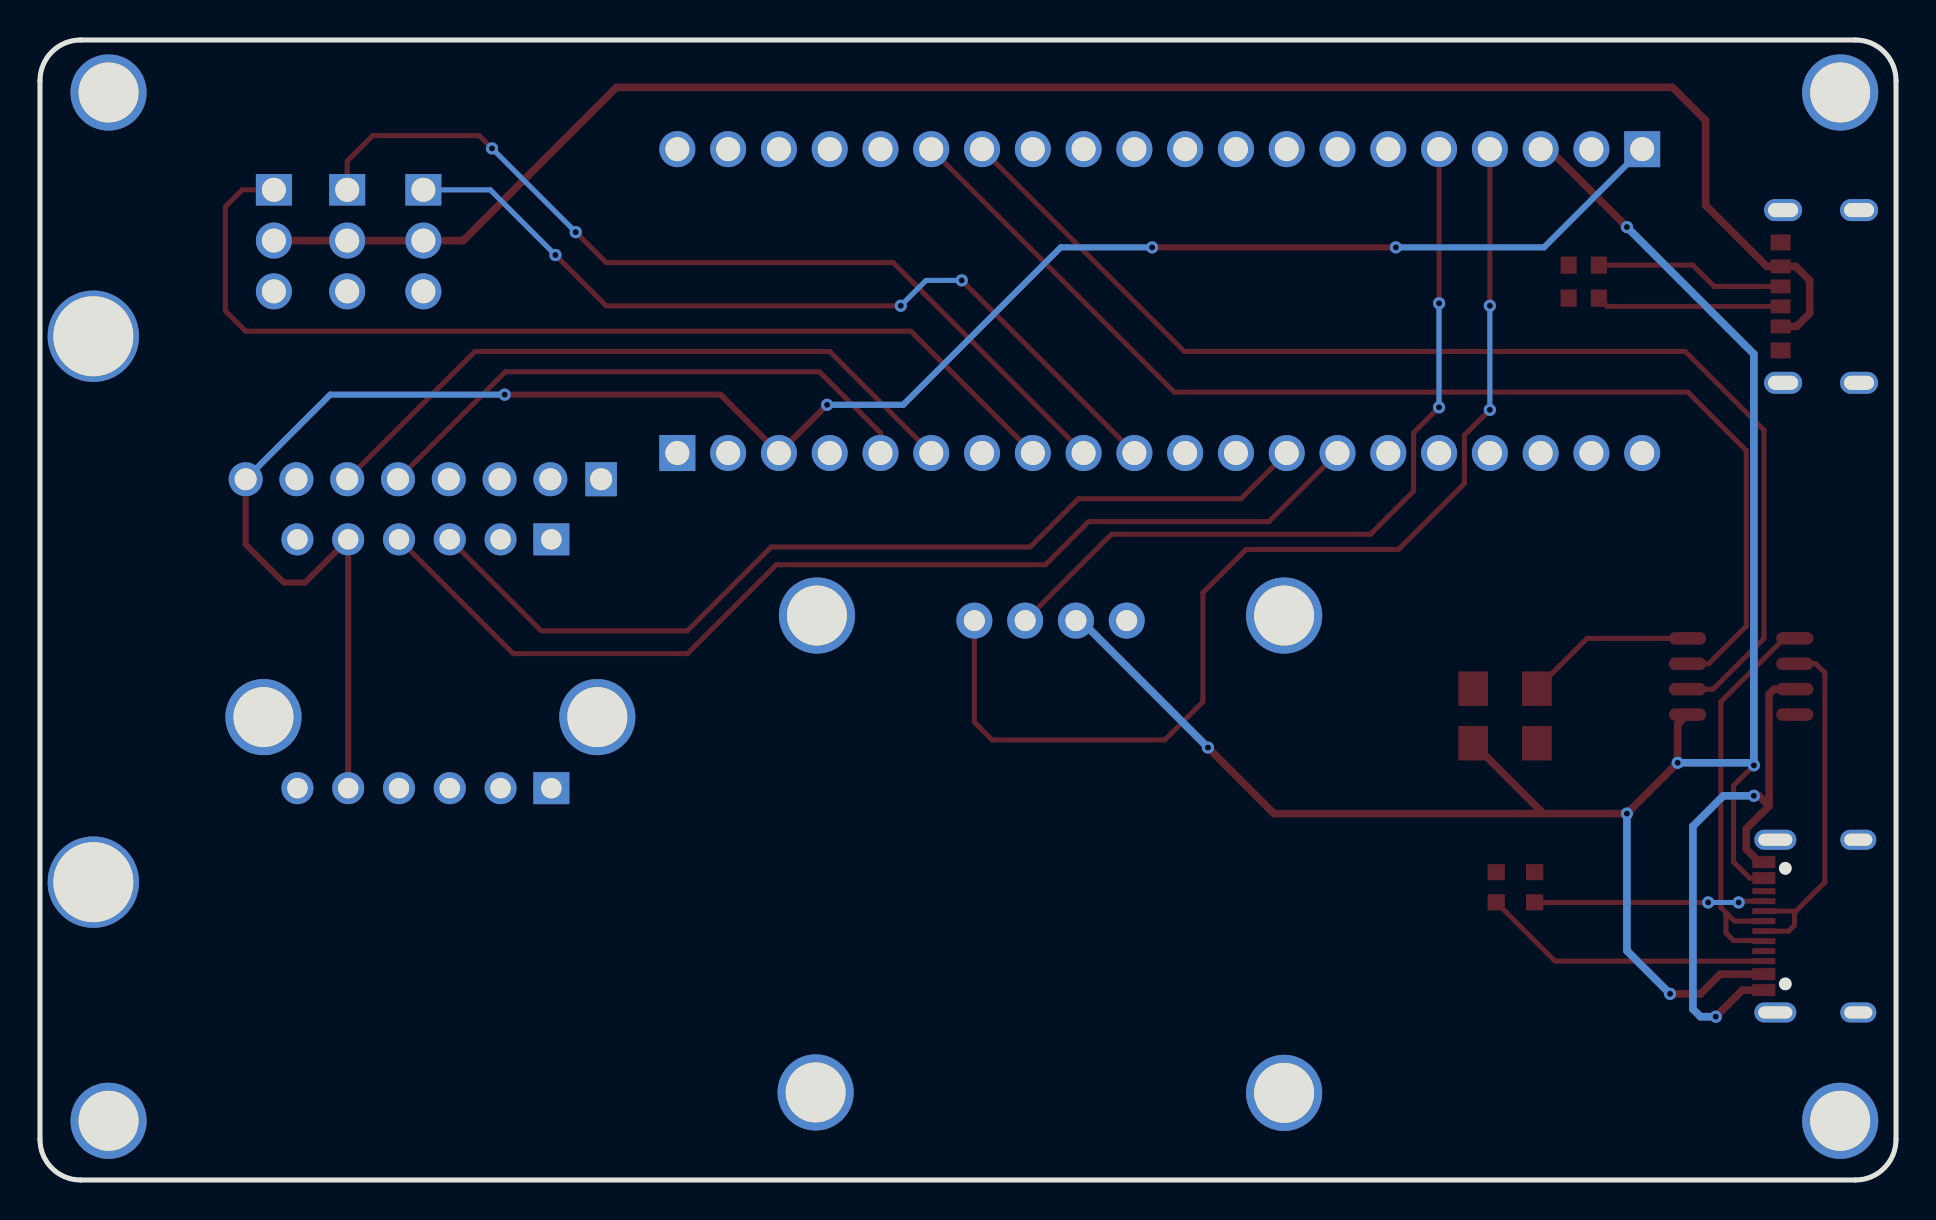
[diagram p7: board, bottom side, seen from below]

Outline 92.84 x 57.02 mm; copper layers: Top Layer, Bottom Layer. Coordinates in mm from the lower left corner of the outline.
Outline path: 0,54.99 0,2.03 arc(0.6,0.6) 2.03,0 90.81,0 arc(92.24,0.6) 92.84,2.03 92.84,54.99 arc(92.24,56.43) 90.81,57.02 2.03,57.02 arc(0.6,56.43) 0,54.99
Stack: Top Layer 0.035mm / Dielectric1 1.51mm FR4 er 4.5 / Bottom Layer 0.035mm

## Design rules (mm)
template: JLCPCB Capability(Two Layers Board)
spacing copperThickness1oz (default): track to track 0.102, other pairs 0.152 to 0.3
spacing copperThickness2oz: track to track 0.203, other pairs 0.152 to 0.3
track width copperThickness1oz (default): min 0.127, default 0.254, max 2.54
track width copperThickness2oz: min 0.203, default 0.254, max 2.54
differential pair differentialPair (default): width min 0.127, default 0.254, max 2.54; gap min 0.152, default 0.152
via viaSize (default): diameter min 0.5, default 0.61, max 10; hole min 0.3, default 0.305, max 6.3

## Placement (name value [footprint] x y rotation side)
C1  100uF  [C1206]  19.56 24.58 180 top
C2  100uF  [C1206]  19.56 21.85 0 top
CH340N  CH340N  [SOP-8_L4.9-W3.9-P1.27-LS6.0-BL]  7.75 25.19 270 top
MPU6050  MPU6050  [HDR-TH_8P-P2.54-V-F]  73.66 35.05 0 top
NOREF  -  [Pad_e148]  89.41 2.96 0 top
NOREF#2  -  [Pad_e140]  90.17 42.2 0 top
NOREF#3  -  [Pad_e150]  2.79 54.4 0 top
NOREF#4  -  [Pad_e114]  64.96 23.15 0 top
NOREF#5  -  [Pad_e147]  89.41 54.4 0 top
NOREF#6  -  [Pad_e118]  30.61 4.36 0 top
NOREF#7  -  [Pad_e139]  81.66 23.15 0 top
NOREF#8  -  [Pad_e119]  54.04 4.38 0 top
NOREF#9  -  [Pad_e149]  2.79 2.96 0 top
NOREF#10  -  [Pad_e124]  53.97 28.23 0 top
NOREF#11  -  [Pad_e117]  30.61 28.23 0 top
NOREF#12  -  [Pad_e141]  90.17 14.9 0 top
OLED  OLED  [OLED-TH_L27.8-W27.2-P2.54_C9900033791]  42.29 27.98 0 top
P1  STM32F103C8T6核心板  [HDR-TH_20P-P2.54-V-F]  36.83 51.56 0 top
P2  Stlink  [HDR-TH_20P-P2.54-V-F]  36.83 36.36 180 top
PITCH角  PITCH角  [HDR-TH_3P-P2.54-V-M-1]  77.47 46.99 270 top
R1  5.1kΩ  [R0603]  20 14.65 90 top
R2  5.1kΩ  [R0603]  18.08 14.65 90 top
R3  5.1kΩ  [R0603]  15.62 44.11 0 top
R4  5.1kΩ  [R0603]  15.62 45.76 0 top
ROLL角  ROLL角  [HDR-TH_3P-P2.54-V-M-1]  73.66 46.99 270 top
WT1-IMUIIC  WT1-IMU IIC  [HDR-TH_6P-P2.54-V-F]  73.61 19.6 0 top
WT1-IMU串口  WT1-IMU串口  [HDR-TH_6P-P2.54-V-F]  73.61 32.04 0 top
YAL角  YAL角  [HDR-TH_3P-P2.54-V-M-1]  81.14 46.99 270 top
舵机电源  舵机电源  [TYPE-C-SMD_TYPE-C-6P]  3.81 44.2 270 top
调试串口  调试串口  [USB-C-SMD_TYPE-C16PIN]  4.25 12.7 270 top

## Footprints (pads in the part's own frame, mm; a bottom-side part is the same pattern mirrored in y, then rotated)
C1206
  rect 1.485x1.728 smd: 1(-1.593,0) 2(1.593,0)
HDR-TH_3P-P2.54-V-M-1
  rect 1.575x1.8 hole 1.2: 1(-2.54,0)
  round 1.8 hole 1.2: 2(0,0) 3(2.54,0)
HDR-TH_6P-P2.54-V-F
  rect 1.8x1.6 hole 1.02: 1(-6.35,0)
  round 1.6 hole 1.02: 2(-3.81,0) 3(-1.27,0) 4(1.27,0) 5(3.81,0) 6(6.35,0)
HDR-TH_8P-P2.54-V-F
  rect 1.575x1.7 hole 1.1: 1(-8.89,0)
  round 1.7 hole 1.1: 2(-6.35,0) 3(-3.81,0) 4(-1.27,0) 5(1.27,0) 6(3.81,0) 7(6.35,0) 8(8.89,0)
HDR-TH_20P-P2.54-V-F
  rect 1.8x1.8 hole 1.2: 1(-24.13,0)
  round 1.8 hole 1.2: 2(-21.59,0) 3(-19.05,0) 4(-16.51,0) 5(-13.97,0) 6(-11.43,0) 7(-8.89,0) 8(-6.35,0) 9(-3.81,0) 10(-1.27,0) 11(1.27,0) 12(3.81,0) 13(6.35,0) 14(8.89,0) 15(11.43,0) 16(13.97,0) 17(16.51,0) 18(19.05,0) 19(21.59,0) 20(24.13,0)
OLED-TH_L27.8-W27.2-P2.54_C9900033791
  round 1.8 hole 1.05: 1(-3.81,0) 2(-1.27,0) 3(1.27,0) 4(3.81,0)
Pad_e114
  round 3.81 hole 2.999: 21(0,0)
Pad_e117
  round 3.81 hole 2.999: 21(0,0)
Pad_e118
  round 3.81 hole 2.999: 21(0,0)
Pad_e119
  round 3.81 hole 2.999: 21(0,0)
Pad_e124
  round 3.81 hole 2.999: 21(0,0)
Pad_e139
  round 3.81 hole 2.999: 21(0,0)
Pad_e140
  round 4.572 hole 4: 21(0,0)
Pad_e141
  round 4.572 hole 4: 21(0,0)
Pad_e147
  round 3.81 hole 2.999: 21(0,0)
Pad_e148
  round 3.81 hole 2.999: 21(0,0)
Pad_e149
  round 3.81 hole 2.999: 21(0,0)
Pad_e150
  round 3.81 hole 2.999: 21(0,0)
R0603
  rect 0.806x0.864 smd: 1(-0.753,0) 2(0.753,0)
SOP-8_L4.9-W3.9-P1.27-LS6.0-BL
  oval 0.63x1.865 smd: 1(-1.905,-2.683) 2(-0.635,-2.683) 3(0.635,-2.683) 4(1.905,-2.683) 5(1.905,2.683) 6(0.635,2.683) 7(-0.635,2.683) 8(-1.905,2.683)
TYPE-C-SMD_TYPE-C-6P
  oval 1.1x1.9 hole 0.7x1.5: 7(-4.32,1.837) 7(-4.32,-1.962) 7(4.32,1.837) 7(4.32,-1.962)
  rect 0.7x1 smd: A5(-0.5,1.962) A9(1.5,1.962) B5(0.5,1.962) B9(-1.5,1.962)
  rect 0.8x1 smd: A12(2.7,1.962) B12(-2.7,1.962)
USB-C-SMD_TYPE-C16PIN
  oval 1x2.1 hole 0.6x1.7: 1(-4.32,1.788) 2(4.32,1.788)
  oval 1x1.8 hole 0.6x1.4: 3(-4.32,-2.362) 4(4.32,-2.362)
  rect 0.6x1.15 smd: A1B12(-3.2,2.362) A4B9(-2.4,2.362) B1A12(3.2,2.362) B4A9(2.4,2.362)
  rect 0.3x1.15 smd: A5(-1.25,2.362) A6(-0.25,2.362) A7(0.25,2.362) A8(-1.75,2.362) B5(1.75,2.362) B6(0.75,2.362) B7(-0.75,2.362) B8(1.25,2.362)

## Nets
As in the schematic.

Pads without a net: CH340N 4; NOREF 21; NOREF#2 21; NOREF#3 21; NOREF#4 21; NOREF#5 21; NOREF#6 21; NOREF#7 21; NOREF#8 21; NOREF#9 21; NOREF#10 21; NOREF#11 21; NOREF#12 21; 舵机电源 7; 调试串口 1 2 3 4 A8 B8

## Via types
v1: diameter 0.61, hole 0.305, Top Layer to Bottom Layer, 23 vias

## Routing (per net, layer and track width the routed paths; a pad name or vN(x,y) marks a point on that pad's centre or on a via; arc(x,y) is an arc through that point)
3.3V: length 101.6
  Top Layer w0.305: v1(69.59,39.28) 58.8,39.28 P2.3 53.47,38.77 v1(53.47,38.78) ; 82.55,35.05 82.55,31.79 80.64,29.89 79.58,29.89 WT1-IMU串口.5 WT1-IMUIIC.5 ; v1(37.21,46.65) v1(25.02,46.65)
  Bottom Layer w0.305: v1(53.47,38.78) 49.66,38.78 41.78,46.65 v1(37.21,46.65) ; v1(25.02,46.65) 17.61,46.65 P1.1 ; v1(69.59,39.28) 78.32,39.28 82.55,35.05
5V: length 89.9
  Top Layer w0.381: YAL角.2 PITCH角.2 ROLL角.2 71.67,46.99 64.01,54.65 11.17,54.65 9.52,53 9.52,48.76 6.46,45.7 舵机电源.B9 5.01,45.7 4.32,45 4.32,43.35 4.97,42.7 舵机电源.A9
GND: length 28.8
  Top Layer w0.381: CH340N.3 6.09,24.55 6.35,24.3 6.35,18.71 ; 6.35,18.71 7.49,17.57 7.49,16.55 6.84,15.9 调试串口.A1B12 ; 6.35,18.71 6.86,19.22 v1(7.11,19.22) ; 调试串口.B1A12 7.68,9.5 v1(9.02,8.17)
  Bottom Layer w0.381: v1(7.11,19.22) 8.63,19.22 10.16,17.69 10.16,8.55 9.78,8.17 v1(9.02,8.17)
V3: length 8.6
  Top Layer w0.254: CH340N.8 15.45,27.09 C1.2
CC1: length 11.5
  Top Layer w0.254: v1(7.87,13.88) 7.81,13.95 调试串口.A5 ; v1(9.4,13.88) 18.07,13.88 R2.1
  Bottom Layer w0.254: v1(7.87,13.88) v1(9.4,13.88)
CC2: length 14.6
  Top Layer w0.254: 调试串口.B5 17.05,10.95 R1.1
MCU5V: length 104.2
  Top Layer w0.254: v1(7.11,20.74) 8.13,19.73 8.13,15.91 7.31,15.1 调试串口.A4B9
  Top Layer w0.381: v1(13.46,47.67) 17.36,51.56 P1.3 ; 17.63,18.33 C2.2 ; 17.63,18.33 v1(13.46,18.33) v1(10.92,20.87) 10.92,22.79 CH340N.5 ; 17.63,18.33 31.11,18.33 v1(34.42,21.63) ; 调试串口.B4A9 8.79,10.3 9.78,9.31 v1(11.3,9.31)
  Bottom Layer w0.381: v1(13.46,47.67) 7.11,41.32 v1(7.11,20.74) 7.24,20.87 v1(10.92,20.87) ; v1(34.42,21.63) 40.77,27.98 OLED.2 ; v1(11.3,9.31) 13.46,11.47 v1(13.46,18.33)
PA2: length 53.5
  Top Layer w0.254: 27.94,36.36 31.36,32.93 40.38,32.93 42.54,30.77 56.01,30.77 60.45,26.33 69.16,26.33 WT1-IMU串口.4
PA3: length 47.4
  Top Layer w0.254: 72.34,32.04 67.77,27.47 60.45,27.47 56.26,31.66 43.31,31.66 40.89,34.08 32.76,34.08 P2.13
PA6: length 42.1
  Top Layer w0.254: P2.10 v1(46.73,45) ; v1(49.78,43.73) 64.51,43.73 v1(67.06,46.27)
  Bottom Layer w0.254: ROLL角.1 70.32,49.53 v1(67.06,46.27) ; v1(46.73,45) 48.51,45 v1(49.78,43.73)
PA7: length 45.4
  Top Layer w0.254: v1(70.23,51.6) 70.86,52.24 76.2,52.24 77.47,50.97 PITCH角.1 ; v1(66.04,47.41) 64.51,45.89 50.16,45.89 P2.9
  Bottom Layer w0.254: v1(70.23,51.6) v1(66.04,47.41)
PA9: length 59.5
  Top Layer w0.254: P1.15 36.1,39.41 10.41,39.41 7.49,36.49 7.49,27.7 9.37,25.82 CH340N.7
PA10: length 60.2
  Top Layer w0.254: P1.14 35.6,41.44 10.54,41.44 6.6,37.51 6.6,27.09 9.14,24.55 CH340N.6
PB0: length 51.3
  Top Layer w0.254: YAL角.1 82.72,49.53 83.56,48.68 83.56,43.47 82.55,42.46 49.27,42.46 P2.8
PB8: length 39.7
  Top Layer w0.254: OLED.3 39.24,32.3 26.29,32.3 24.13,34.46 24.13,37.38 v1(22.86,38.65) ; P1.5 v1(22.86,43.85)
  Bottom Layer w0.254: v1(22.86,38.65) 22.86,43.85 v1(22.86,43.85)
PB9: length 55.7
  Top Layer w0.254: P1.4 v1(20.32,43.73) ; OLED.4 46.1,22.9 45.21,22.01 36.57,22.01 34.67,23.92 34.67,29.38 32.51,31.54 24.89,31.54 21.59,34.84 21.59,37.25 21.33,37.51 21.33,37.51 v1(20.32,38.52)
  Bottom Layer w0.254: v1(20.32,43.73) v1(20.32,38.52)
PB10: length 34
  Top Layer w0.254: P2.6 53.34,41.44 71.08,41.44 MPU6050.6
PB11: length 28.6
  Top Layer w0.254: P2.5 50.8,37.38 53.85,40.43 69.56,40.43 MPU6050.5
UD+: length 20.2
  Top Layer w0.254: CH340N.1 5.59,27.09 8.76,23.92 8.76,13.63 8.51,13.38 ; 调试串口.A6 8.08,12.95 8.51,13.38 ; 8.51,13.38 8.51,12.36 8.13,11.98 7.24,11.98
UD-: length 18.2
  Top Layer w0.254: 5,13.45 5.08,13.38 5.08,12.74 5.37,12.45 调试串口.A7 ; 5,13.45 调试串口.B7 ; 5,13.45 3.55,14.9 3.55,25.37 4,25.82 CH340N.2
$3N1347: length 9.3
  Top Layer w0.254: R3.1 14.45,43.7 舵机电源.B5
$3N1356: length 9.5
  Top Layer w0.254: 舵机电源.A5 9.09,44.7 10.16,45.76 R4.1

## Copper pours and planes (outline as drawn; the poured copper is in the pictures)
GND on Top Layer: 0.59,56.43 92.24,56.43 92.24,0.59 0.59,0.59

## Text on the board
Top Silkscreen Layer: Stlink | STM32F103C8T6核心板 | 数据线 | GND | 5V
